# EAGLE design telekinesis-eagle (EAGLE 7.1.0)
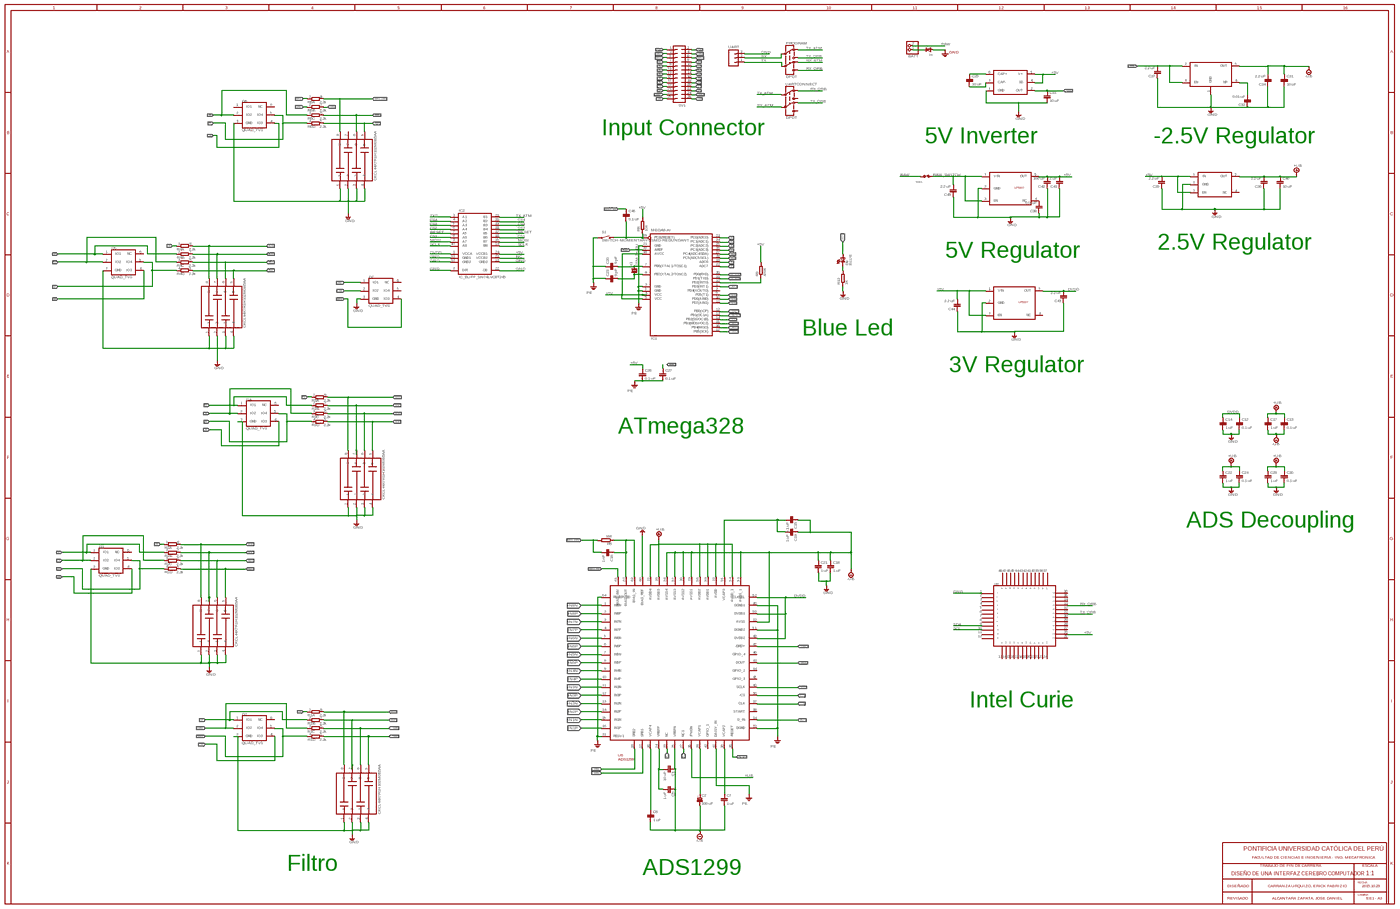
[diagram p0: schematic, sheet 1, overview]
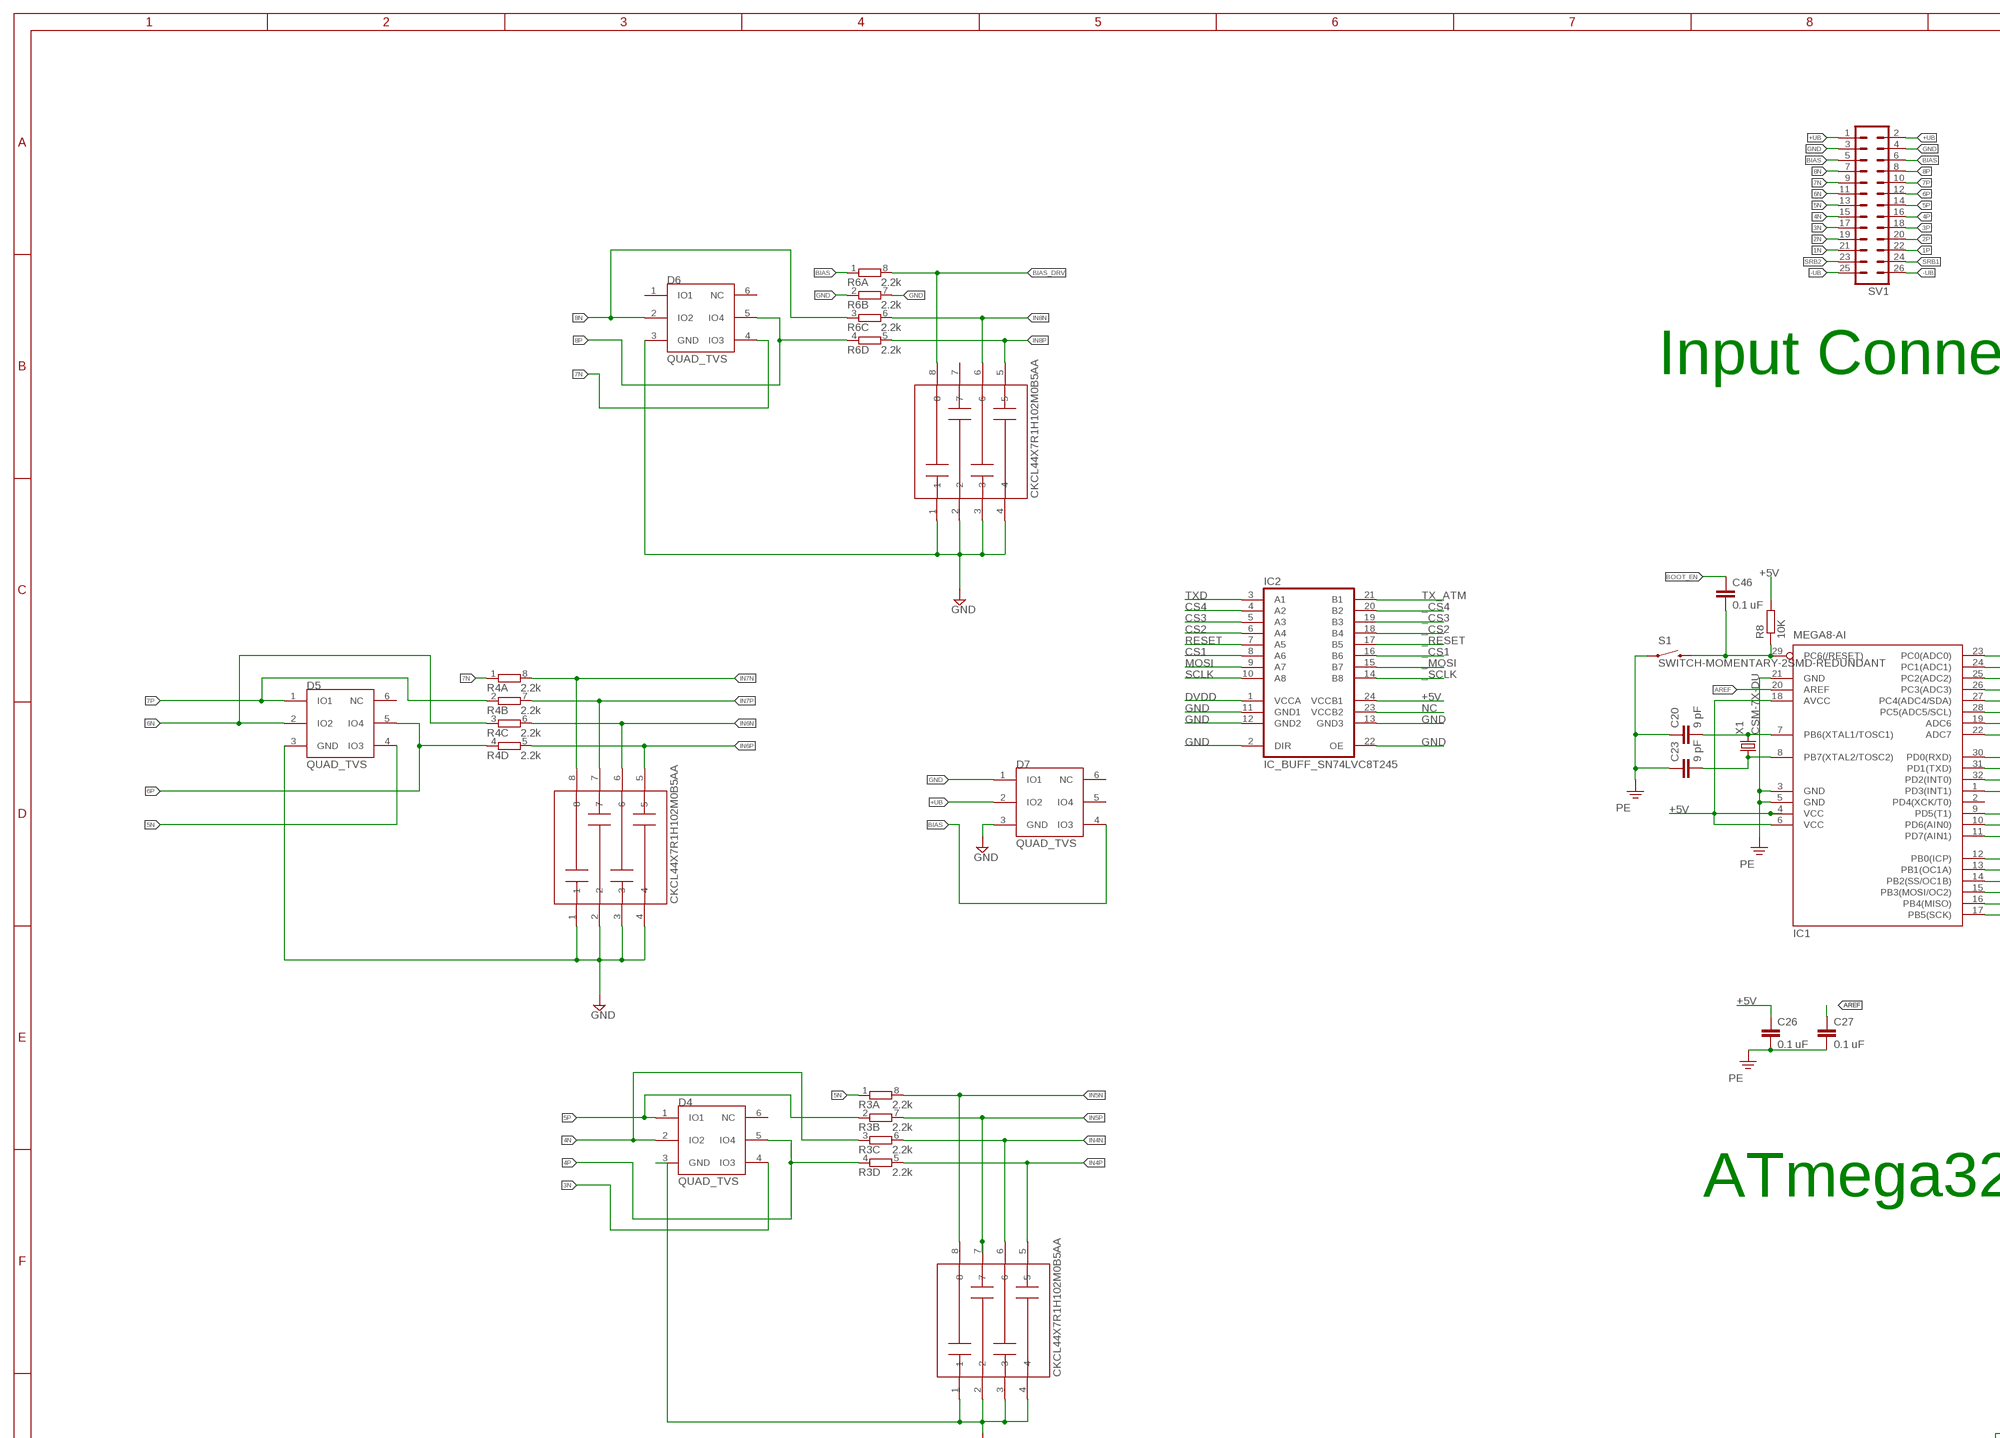
[diagram p1: schematic, sheet 1, part 1 of 4]
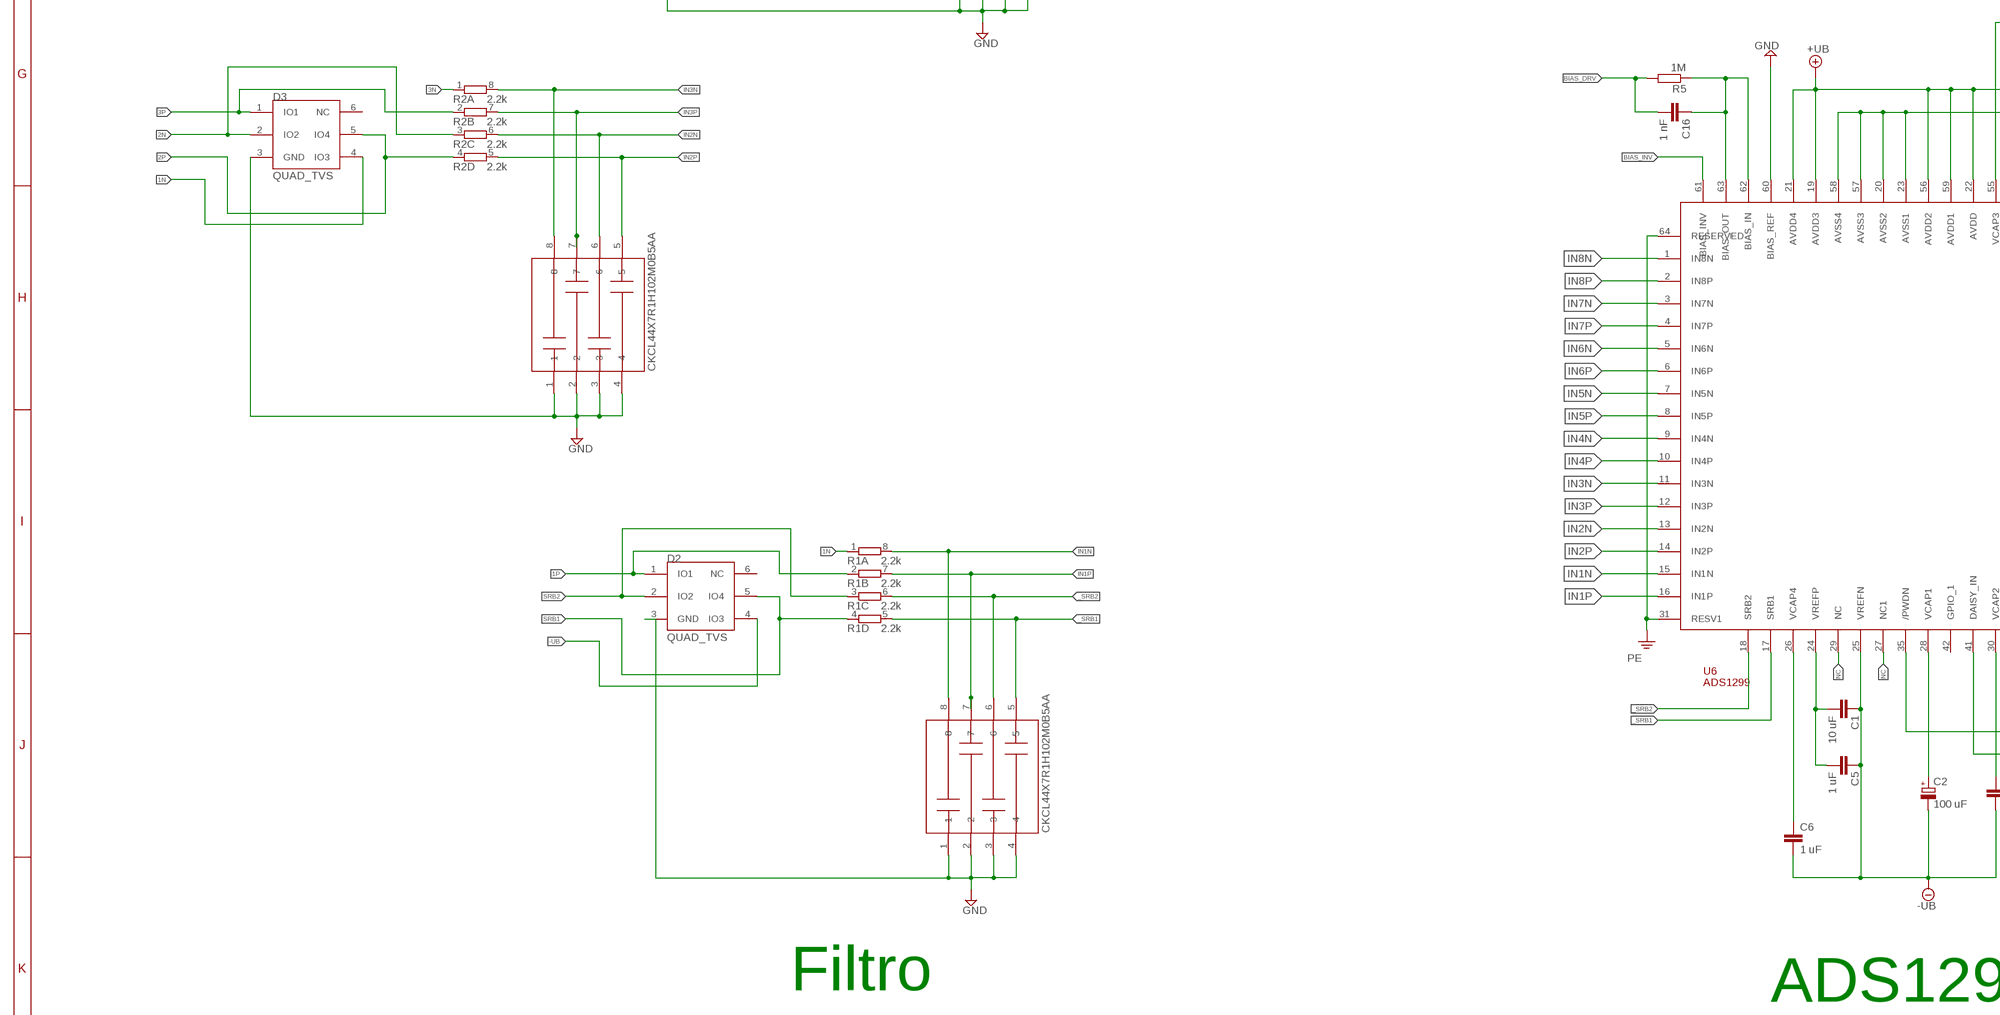
[diagram p2: schematic, sheet 1, part 2 of 4]
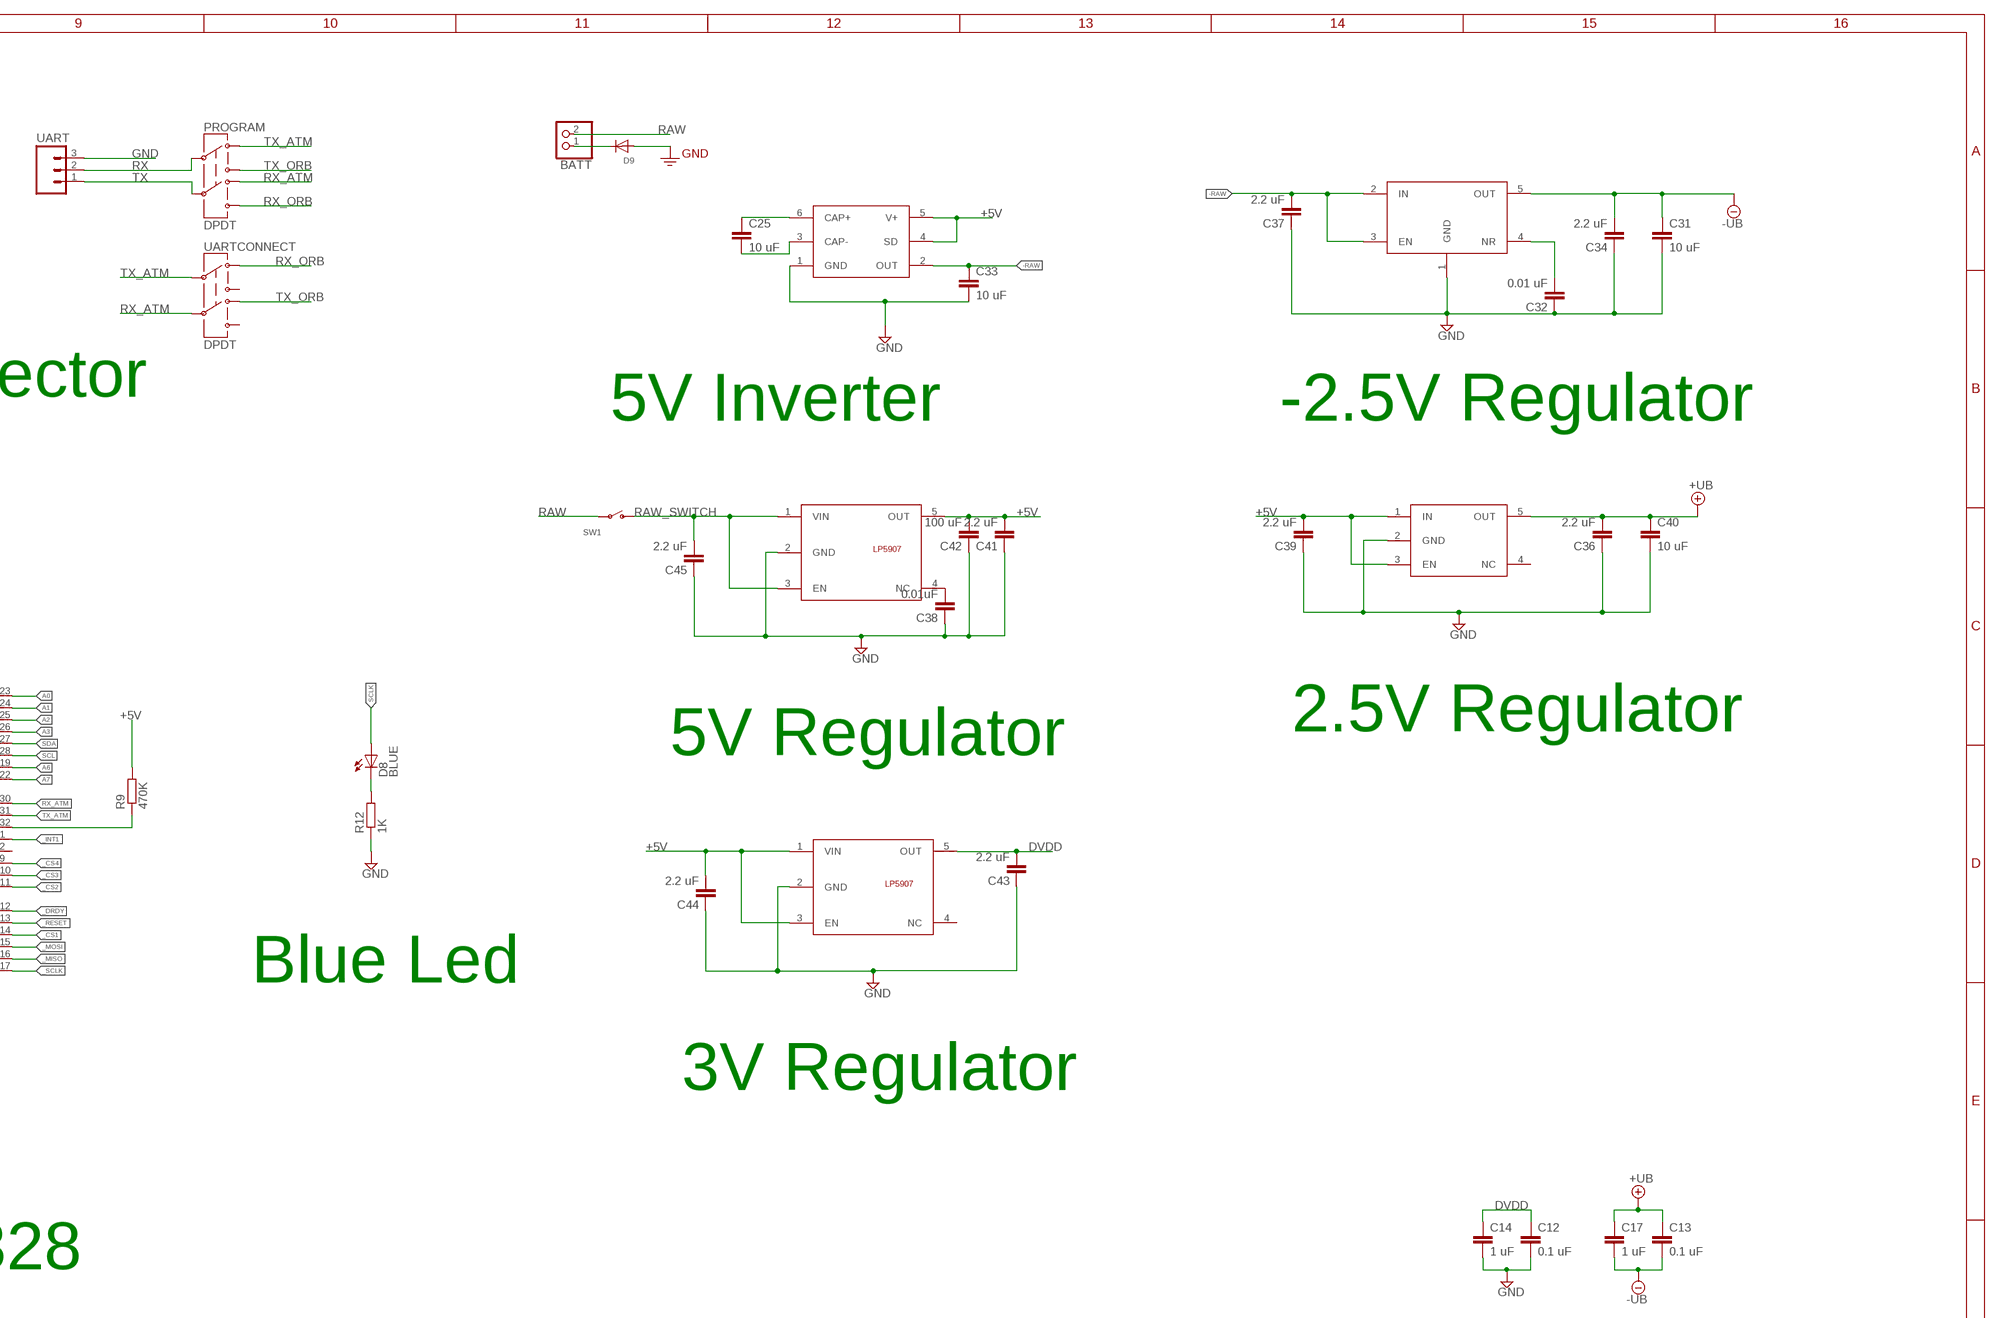
[diagram p3: schematic, sheet 1, part 3 of 4]
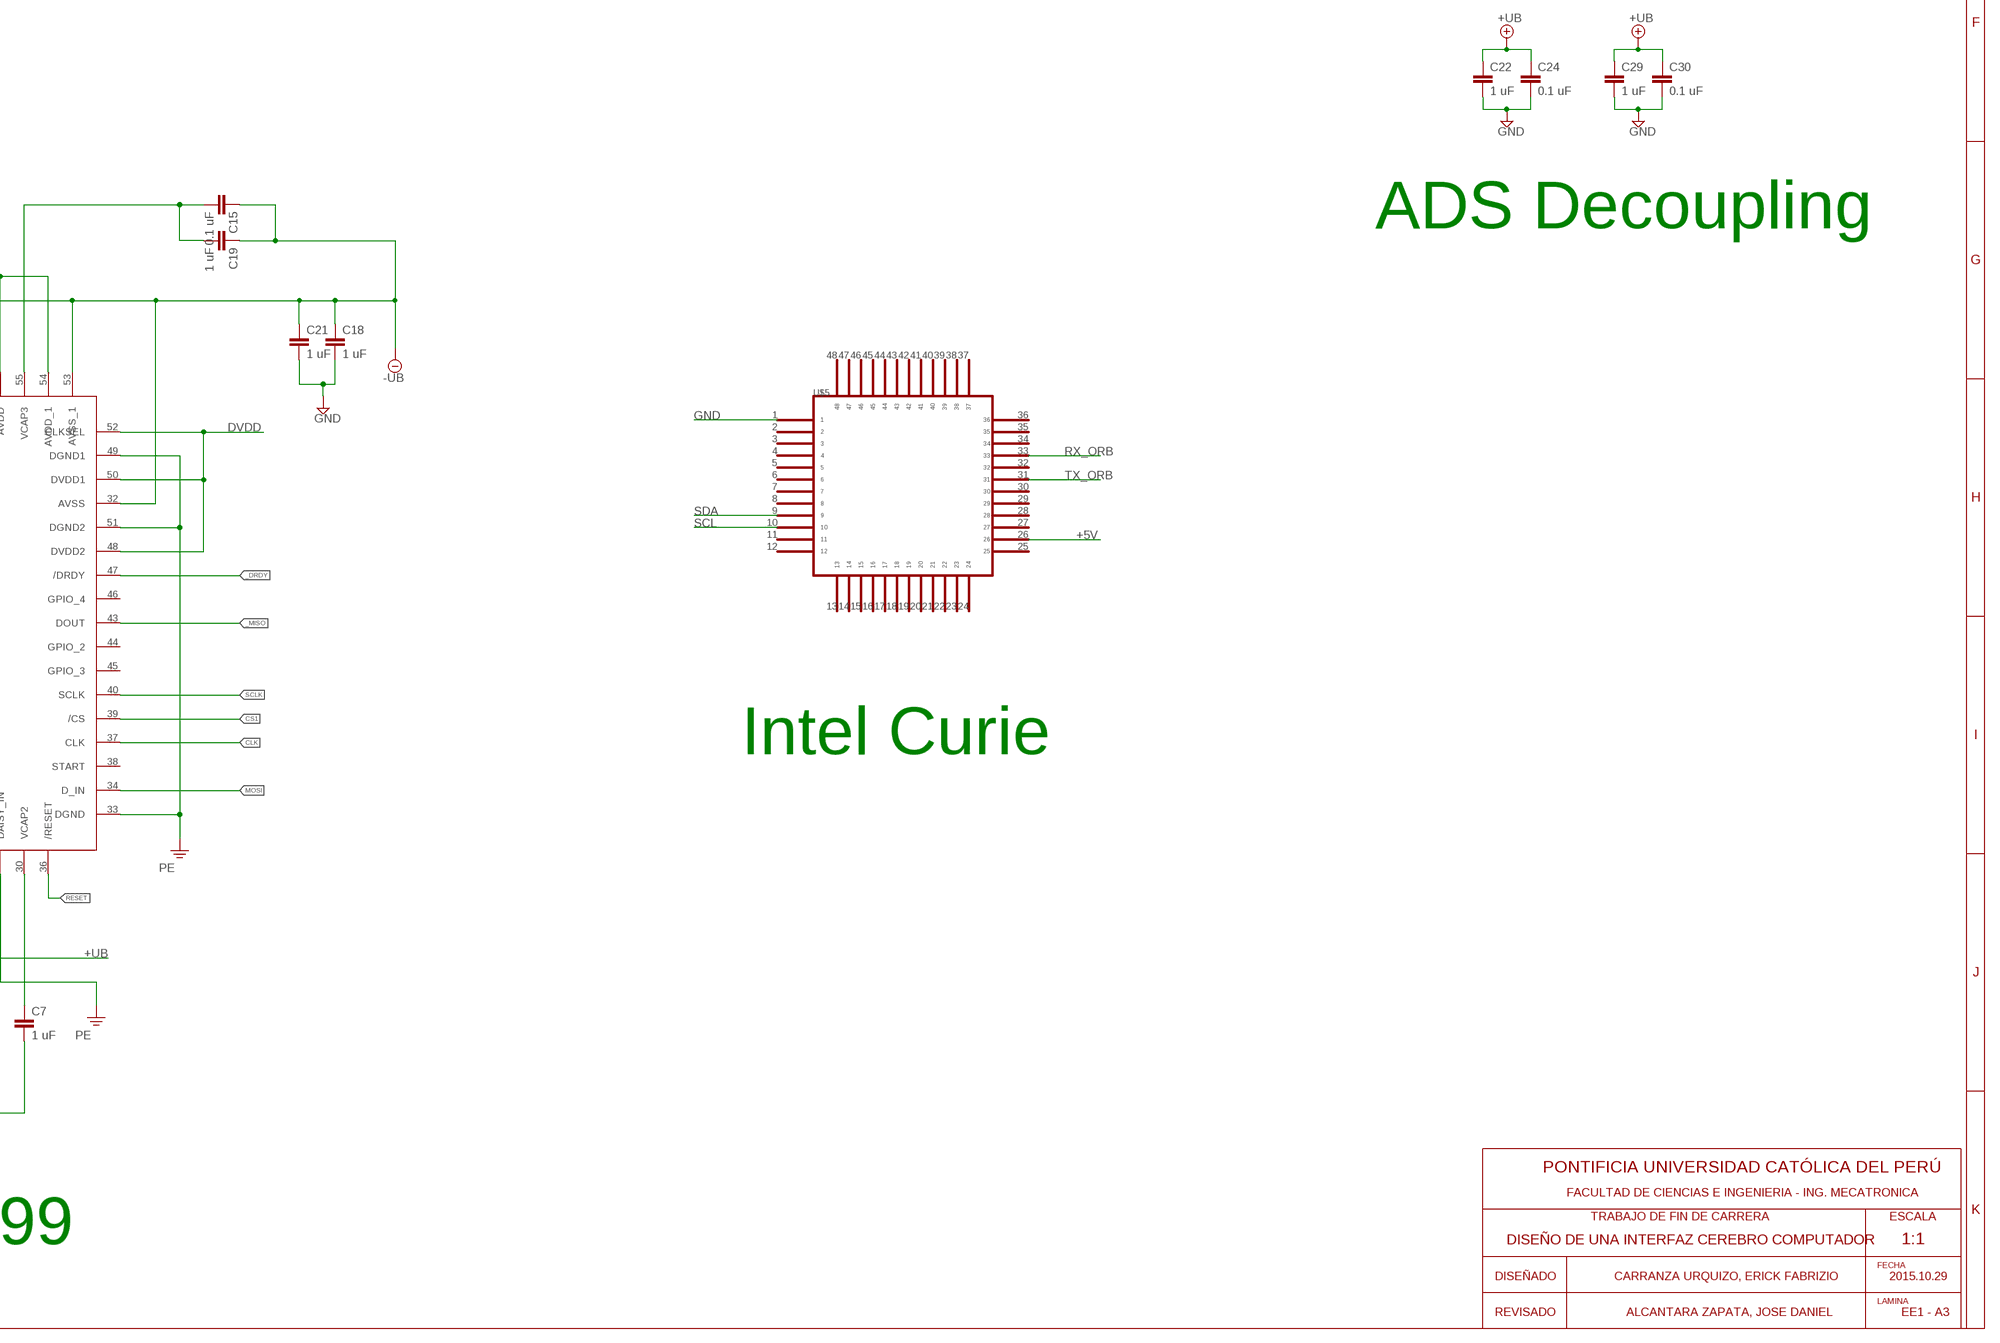
[diagram p4: schematic, sheet 1, part 4 of 4]

## Parts
BATT  JST_2PIN  [JSTPH2]
C1  10 uF  C-EUC0805K  [C0805K]
C2  100 uF  CPOL-EUC/6032-28R  [C/6032-28R]
C3  CKCL44X7R1H102M0B5AA  [CKCL44]
C5  1 uF  C-EUC0805K  [C0805K]
C6  1 uF  C-EUC0805K  [C0805K]
C7  1 uF  C-EUC0805K  [C0805K]
C9  CKCL44X7R1H102M0B5AA  [CKCL44]
C11  CKCL44X7R1H102M0B5AA  [CKCL44]
C12  0.1 uF  C-EUC0805K  [C0805K]
C13  0.1 uF  C-EUC0805K  [C0805K]
C14  1 uF  C-EUC0805K  [C0805K]
C15  0.1 uF  C-EUC0805K  [C0805K]
C16  1 nF  C-EUC0805K  [C0805K]
C17  1 uF  C-EUC0805K  [C0805K]
C18  1 uF  C-EUC0805K  [C0805K]
C19  1 uF  C-EUC0805K  [C0805K]
C20  9 pF  C-EUC0805K  [C0805K]
C21  1 uF  C-EUC0805K  [C0805K]
C22  1 uF  C-EUC0805K  [C0805K]
C23  9 pF  C-EUC0805K  [C0805K]
C24  0.1 uF  C-EUC0805K  [C0805K]
C25  10 uF  C-EUC0805K  [C0805K]
C26  0.1 uF  C-EUC0805K  [C0805K]
C27  0.1 uF  C-EUC0805K  [C0805K]
C28  CKCL44X7R1H102M0B5AA  [CKCL44]
C29  1 uF  C-EUC0805K  [C0805K]
C30  0.1 uF  C-EUC0805K  [C0805K]
C31  10 uF  C-EUC0805K  [C0805K]
C32  0.01 uF  C-EUC0805K  [C0805K]
C33  10 uF  C-EUC0805K  [C0805K]
C34  2.2 uF  C-EUC0805K  [C0805K]
C35  CKCL44X7R1H102M0B5AA  [CKCL44]
C36  2.2 uF  C-EUC0805K  [C0805K]
C37  2.2 uF  C-EUC0805K  [C0805K]
C38  0.01uF  C-EUC0805K  [C0805K]
C39  2.2 uF  C-EUC0805K  [C0805K]
C40  10 uF  C-EUC0805K  [C0805K]
C41  2.2 uF  C-EUC0805K  [C0805K]
C42  100 uF  C-EUC0805K  [C0805K]
C43  2.2 uF  C-EUC0805K  [C0805K]
C44  2.2 uF  C-EUC0805K  [C0805K]
C45  2.2 uF  C-EUC0805K  [C0805K]
C46  0.1 uF  C-EUC0805K  [C0805K]
D2  QUAD_TVS  [QUAD_TVS]
D3  QUAD_TVS  [QUAD_TVS]
D4  QUAD_TVS  [QUAD_TVS]
D5  QUAD_TVS  [QUAD_TVS]
D6  QUAD_TVS  [QUAD_TVS]
D7  QUAD_TVS  [QUAD_TVS]
D8  BLUE  LEDSML0603  [SML0603]
D9  DIODESOD-123  [SOD-123]
IC1  MEGA8-AI  [TQFP32-08]
IC2  IC_BUFF_SN74LVC8T245  [SOIC-24]
PROGRAM  DPDT  SWITCH-DPDTAYZ0202  [AYZ0202]
R1  2.2k  4R-NCAY16  [CAY16]
R2  2.2k  4R-NCAY16  [CAY16]
R3  2.2k  4R-NCAY16  [CAY16]
R4  2.2k  4R-NCAY16  [CAY16]
R5  1M  R-EU_R0805W  [R0805W]
R6  2.2k  4R-NCAY16  [CAY16]
R8  10K  R-EU_R0805W  [R0805W]
R9  470K  R-EU_R0805W  [R0805W]
R12  1K  R-EU_R0805W  [R0805W]
S1  SWITCH-MOMENTARY-2SMD-REDUNDANT  [TACTILE-SWITCH-SMD]
SV1  MA13-2W  [MA13-2W]
SW1  SWITCH_SPST  [SPST_SMT_19192]
U3  LM2664  [SOT-23-6]
U4  TLV700XX  [SC70-5]
U5  LP5907  [LP5907]
U6  ADS_1299  [TQFP64_ADS]
U9  LP5907  [LP5907]
U$5  ORB_0  [ORB_52_22MM]
UART  M03PTH  [1X03]
UARTCONNECT  DPDT  SWITCH-DPDTAYZ0202  [AYZ0202]
VR1  TPS72325  [SM]
X1  CSM-7X-DU  [CSM-7X-DU]

## Nets
1N: D3.4(IO3) R1.1 SV1.21
1P: D2.1(IO1) R1.2 SV1.22
2N: D3.2(IO2) R2.3 SV1.19
2P: D3.5(IO4) R2.4 SV1.20
3N: D4.4(IO3) R2.1 SV1.17
3P: D3.1(IO1) R2.2 SV1.18
4N: D4.2(IO2) R3.3 SV1.15
4P: D4.5(IO4) R3.4 SV1.16
5N: D5.4(IO3) R3.1 SV1.13
5P: D4.1(IO1) R3.2 SV1.14
6N: D5.2(IO2) R4.3 SV1.11
6P: D5.5(IO4) R4.4 SV1.12
7N: D6.4(IO3) R4.1 SV1.9
7P: D5.1(IO1) R4.2 SV1.10
8N: D6.2(IO2) R6.3 SV1.7
8P: D6.5(IO4) R6.4 SV1.8
+5V: C26.1 C39.2 C41.2 C42.2 C44.2 IC1.4(VCC) IC1.6(VCC) IC1.18(AVCC) IC2.24(VCCB1) R8.2 R9.2 U3.4(SD) U3.5(V+) U4.1(IN) U4.3(EN) U5.1(VIN) U5.3(EN) U9.5(OUT) U$5.26
+UB: C13.1 C17.1 C22.1 C24.1 C29.1 C30.1 C36.2 C40.1 D7.2(IO2) SV1.1 SV1.2 U4.5(OUT) U6.19(AVDD3) U6.21(AVDD4) U6.22(AVDD) U6.35(/PWDN) U6.54(AVDD_1) U6.56(AVDD2) U6.59(AVDD1)
-RAW: C33.1 C37.2 U3.2(OUT) VR1.2(IN) VR1.3(EN)
-UB: C1.1 C2.- C5.1 C6.2 C7.2 C13.2 C15.1 C17.2 C18.1 C19.1 C21.1 C31.1 C34.2 D2.4(IO3) SV1.25 SV1.26 U6.20(AVSS2) U6.23(AVSS1) U6.25(VREFN) U6.32(AVSS) U6.53(AVSS_1) U6.57(AVSS3) U6.58(AVSS4) VR1.5(OUT)
_CS1: IC1.14(PB2(SS/OC1B)) IC2.16(B6)
_CS2: IC1.11(PD7(AIN1)) IC2.18(B4)
_CS3: IC1.10(PD6(AIN0)) IC2.19(B3)
_CS4: IC1.9(PD5(T1)) IC2.20(B2)
_DRDY: IC1.12(PB0(ICP)) U6.47(/DRDY)
_INT1: IC1.1(PD3(INT1))
_MISO: IC1.16(PB4(MISO)) U6.43(DOUT)
_MOSI: IC1.15(PB3(MOSI/OC2)) IC2.15(B7)
_RESET: IC1.13(PB1(OC1A)) IC2.17(B5)
_SCLK: IC1.17(PB5(SCK)) IC2.14(B8)
_SRB1: C3.5 R1.5 U6.17(SRB1)
_SRB2: C3.6 R1.6 U6.18(SRB2)
A0: IC1.23(PC0(ADC0))
A1: IC1.24(PC1(ADC1))
A2: IC1.25(PC2(ADC2))
A3: IC1.26(PC3(ADC3))
A6: IC1.19(ADC6)
A7: IC1.22(ADC7)
ARDUINO_RESET: C46.2 IC1.29(PC6(/RESET)) R8.1 S1.3 S1.4
AREF: C27.1 IC1.20(AREF)
BIAS: D7.4(IO3) R6.1 SV1.5 SV1.6
BIAS_DRV: C16.2 C35.8 R5.2 R6.8
BIAS_INV: U6.61(BIAS_INV)
BOOT_EN: C46.1
CLK: U6.37(CLK)
CS1: IC2.8(A6) U6.39(/CS)
CS2: IC2.6(A4)
CS3: IC2.5(A3)
CS4: IC2.4(A2)
DVDD: C12.1 C14.1 C43.2 IC2.1(VCCA) U5.5(OUT) U6.48(DVDD2) U6.50(DVDD1) U6.52(CLKSEL)
GND: C3.1 C3.2 C3.3 C3.4 C9.1 C9.2 C9.3 C9.4 C11.1 C11.2 C11.3 C11.4 C12.2 C14.2 C18.2 C21.2 C22.2 C24.2 C28.1 C28.2 C28.3 C28.4 C29.2 C30.2 C31.2 C32.1 C33.2 C34.1 C35.1 C35.2 C35.3 C35.4 C36.1 C37.1 C38.1 C39.1 C40.2 C41.1 C42.1 C43.1 C44.1 C45.1 D2.3(GND) D3.3(GND) D4.3(GND) D5.3(GND) D6.3(GND) D7.1(IO1) D7.3(GND) D9.A IC2.2(DIR) IC2.11(GND1) IC2.12(GND2) IC2.13(GND3) IC2.22(OE) R6.2 R6.7 R12.1 SV1.3 SV1.4 U3.1(GND) U4.2(GND) U5.2(GND) U6.31(RESV1) U6.33(DGND) U6.41(DAISY_IN) U6.49(DGND1) U6.51(DGND2) U6.60(BIAS_REF) U6.64(RESERVED) U9.2(GND) U$5.1 UART.3 VR1.1(GND) ; supply symbol labelled GND2, PE
IN1N: C3.8 R1.8 U6.15(IN1N)
IN1P: C3.7 R1.7 U6.16(IN1P)
IN2N: C9.6 R2.6 U6.13(IN2N)
IN2P: C9.5 R2.5 U6.14(IN2P)
IN3N: C9.8 R2.8 U6.11(IN3N)
IN3P: C9.7 R2.7 U6.12(IN3P)
IN4N: C11.6 R3.6 U6.9(IN4N)
IN4P: C11.5 R3.5 U6.10(IN4P)
IN5N: C11.8 R3.8 U6.7(IN5N)
IN5P: C11.7 R3.7 U6.8(IN5P)
IN6N: C28.6 R4.6 U6.5(IN6N)
IN6P: C28.5 R4.5 U6.6(IN6P)
IN7N: C28.8 R4.8 U6.3(IN7N)
IN7P: C28.7 R4.7 U6.4(IN7P)
IN8N: C35.6 R6.6 U6.1(IN8N)
IN8P: C35.5 R6.5 U6.2(IN8P)
MOSI: IC2.9(A7) U6.34(D_IN)
N$1: IC1.32(PD2(INT0)) R9.1
N$2: C20.2 IC1.7(PB6(XTAL1/TOSC1)) X1.2
N$3: C23.2 IC1.8(PB7(XTAL2/TOSC2)) X1.1
N$4: C16.1 R5.1 U6.62(BIAS_IN) U6.63(BIAS_OUT)
N$5: C15.2 C19.2 U6.55(VCAP3)
N$6: C6.1 U6.26(VCAP4)
N$7: C1.2 C5.2 U6.24(VREFP)
N$8: C2.+ U6.28(VCAP1)
N$9: C25.1 U3.6(CAP+)
N$10: C7.1 U6.30(VCAP2)
N$11: C25.2 U3.3(CAP-)
N$12: C32.2 VR1.4(NR)
N$14: D8.C R12.2
N$38: C38.2 U9.4(NC)
NC: IC2.23(VCCB2) U6.27(NC1) U6.29(NC)
NULL: BATT.1 D9.C
PE: C20.1 C23.1 C26.2 C27.2 IC1.3(GND) IC1.5(GND) IC1.21(GND) S1.1 S1.2
RAW: BATT.2 SW1.B(P)
RAW_SWITCH: C45.2 SW1.C(S) U9.1(VIN) U9.3(EN)
RESET: IC2.7(A5) U6.36(/RESET)
RX: PROGRAM.2 UART.2
RX_ATM: IC1.30(PD0(RXD)) PROGRAM.4 UARTCONNECT.5
RX_ORB: PROGRAM.6 U$5.33 UARTCONNECT.1
SCL: IC1.28(PC5(ADC5/SCL)) U$5.10
SCLK: D8.A IC2.10(A8) U6.40(SCLK)
SDA: IC1.27(PC4(ADC4/SDA)) U$5.9
SRB1: D2.5(IO4) R1.4 SV1.24
SRB2: D2.2(IO2) R1.3 SV1.23
TX: PROGRAM.5 UART.1
TX_ATM: IC1.31(PD1(TXD)) IC2.21(B1) PROGRAM.1 UARTCONNECT.2
TX_ORB: PROGRAM.3 U$5.31 UARTCONNECT.4
TXD: IC2.3(A1)
Unconnected: C35.7 D2.6(NC) D3.6(NC) D4.6(NC) D5.6(NC) D6.1(IO1) D6.6(NC) D7.5(IO4) D7.6(NC) IC1.2(PD4(XCK/T0)) U4.4(NC) U5.4(NC) U6.38(START) U6.42(GPIO_1) U6.44(GPIO_2) U6.45(GPIO_3) U6.46(GPIO_4) U$5.2 U$5.3 U$5.4 U$5.5 U$5.6 U$5.7 U$5.8 U$5.11 U$5.12 U$5.13 U$5.14 U$5.15 U$5.16 U$5.17 U$5.18 U$5.19 U$5.20 U$5.21 U$5.22 U$5.23 U$5.24 U$5.25 U$5.27 U$5.28 U$5.29 U$5.30 U$5.32 U$5.34 U$5.35 U$5.36 U$5.37 U$5.38 U$5.39 U$5.40 U$5.41 U$5.42 U$5.43 U$5.44 U$5.45 U$5.46 U$5.47 U$5.48 UARTCONNECT.3 UARTCONNECT.6

## Notes on the sheet
- Input Connector
- 5V Inverter | -2.5V Regulator
- 2.5V Regulator
- 5V Regulator
- Blue Led
- 3V Regulator
- ATmega328
- ADS Decoupling
- Intel Curie
- Filtro | ADS1299

## Library data of the parts
BATT = microbuilder:JST_2PIN: JST 2-Pin Right-Angle Connector PH-Series - 4UConnector: 17311 SH-Series - 4UConnector: 07278
C1 C5-C7 C12-C27 C29-C34 C36-C46 = resistor:C-EU: CAPACITOR, European symbol
C2 = rcl:CPOL-EU: POLARIZED CAPACITOR, European symbol
C3 C9 C11 C28 C35 = TesisErick:CKCL44X7R1H102M0B5AA
D2-D7 = TVS_DIODE:QUAD_TVS
D8 = led:LED: LED OSRAM: - CHIPLED LG R971, LG N971, LY N971, LG Q971, LY Q971, LO R971, LY R971 LH N974, LH R974 LS Q976, LO Q976, LY Q976 LO Q996 - Hyper CHIPLED LW Q18S LB Q993, LB Q99A, LB R99A - SideLED LS A670, LO A670, LY A670, LG A670, LP A670 LB A673, LV A673, LT A673, LW A673 LH A674 LY A675 LS A676, LA A676, LO A676, LY A676, LW A676 LS A679, LY A679, LG A679 - Hyper Micro SIDELED® LS Y876, LA Y876, LO Y876, LY Y876 LT Y87S - SmartLED LW L88C, LW L88S LB L89C, LB L89S, LG L890 LS L89K, LO L89K, LY L89K LS L896, LA L896, LO L896, LY L896 - TOPLED LS T670, LO T670, LY T670, LG T670, LP T670 LSG T670, LSP T670, LSY T670, LOP T670, LYG T670 LG T671, LOG T671, LSG T671 LB T673, LV T673, LT T673, LW T673 LH T674 LS T676, LA T676, LO T676, LY T676, LB T676, LH T676, LSB T676, LW T676 LB T67C, LV T67C, LT T67C, LS T67K, LO T67K, LY T67K, LW E67C LS E67B, LA E67B, LO E67B, LY E67B, LB E67C, LV E67C, LT E67C LW T67C LS T679, LY T679, LG T679 LS T770, LO T770, LY T770, LG T770, LP T770 LB T773, LV T773, LT T773, LW T773 LH T774 LS E675, LA E675, LY E675, LS T675 LS T776, LA T776, LO T776, LY T776, LB T776 LHGB T686 LT T68C, LB T68C - Hyper Mini TOPLED® LB M676 - Mini TOPLED Santana® LG M470 LS M47K, LO M47K, LY M47K Source: http://www.osram.convergy.de LUXEON: - LUMILED® LXK2-PW12-R00, LXK2-PW12-S00, LXK2-PW14-U00, LXK2-PW14-V00 LXK2-PM12-R00, LXK2-PM12-S00, LXK2-PM14-U00 LXK2-PE12-Q00, LXK2-PE12-R00, LXK2-PE12-S00, LXK2-PE14-T00, LXK2-PE14-U00 LXK2-PB12-K00, LXK2-PB12-L00, LXK2-PB12-M00, LXK2-PB14-N00, LXK2-PB14-P00, LXK2-PB14-Q00 LXK2-PR12-L00, LXK2-PR12-M00, LXK2-PR14-Q00, LXK2-PR14-R00 LXK2-PD12-Q00, LXK2-PD12-R00, LXK2-PD12-S00 LXK2-PH12-R00, LXK2-PH12-S00 LXK2-PL12-P00, LXK2-PL12-Q00, LXK2-PL12-R00 Source: www.luxeon.com KINGBRIGHT: KA-3528ASYC Source: www.kingbright.com
D9 = microbuilder:DIODE: Diode SMA Model Volts Amps Type Vf Vr Digikey # Notes SSA34-E3 40V 3A Schottky 480mV @ 3A 200uA @ 40V SSA34-E3/61TGITR-ND CDBA120-G 20V 1A Schottky 500mV @ 1A 500uA @ 20V 641-1014-6-ND REEL MBRA210 10V 2A Schottky 350mV @ 2A 700uA @ 10V MBRA210LT3 SOD-123 Model Volts Amps Type Vf Vr Order # Notes BAT54T1G 30V 200mA Schottky 800mV @ 200mA 2uA @ 25V BAT54T1GOSTR-ND B0530W 30V 500mA Schottky 430mV @ 500mA 130uA @ 30V B0530W-FDICT-ND REEL MBR120 1A 20V Schottky 340mV @ 1A MBR120VLSFT1GOSCT-ND SOD-323 Model Volts Amps Type Vf Vr Order # Notes PMEG2005EJ 20V 500mA Schottky 355mV @ 500mA 568-4110-1-ND ZLLS410 10V 570mA Schottky 380mV @ 570mA ZLLS410CT-ND 1N4148WS 75V 150mA Silicon/Simple 1V 1N4148WSFSCT-ND REEL SOD-523 Model Volts Amps Type Vf Vr Order # Notes BAT54XV2 30V 200mA Schottky 0.8V @ 100mA BAT54XV2CT-ND TB751S 30V 30mA Schottky RB751S-40TE61CT-ND SOT23-R/W (R = Solder Paste/Reflow Ovens, W = Hand-Soldering) Model Volts Amps Type Vf Vr Order # Notes BAT54FILM 40V 300mA Schottky 497-7162-1-ND
IC1 = atmel:MEGA8: MICROCONTROLLER 8 Kbytes FLASH, 1 kbytes SRAM, 512 bytes EEPROM, USART, 6-channel 10 bit ADC, 2-channel 8 bit ADC Pin compatible with Atmega48, ATMega88, ATMega168 Source: avr.lbr; MPN: ATMEGA8-16AU; OC_FARNELL: 9171371; OC_NEWARK: 73M8863
IC2 = dp_devices:IC_BUFF_SN74LVC8T245
PROGRAM UARTCONNECT = SparkFun-Electromechanical:SWITCH-DPDT: DPDT Version of the COM-00597; PROD_ID: SWCH-08179
R1-R4 R6 = resistor-dil:4R-N: Array Chip Resistor Source: RS Component / Phycomp; OC_FARNELL: unknown; OC_NEWARK: unknown
R5 R8 R9 R12 = resistor:R-EU_: RESISTOR, European symbol
S1 = SparkFun-Electromechanical:SWITCH-MOMENTARY-2: Various NO switches- pushbuttons, reed, etc; PROD_ID: SWCH-08247
SV1 = con-lstb:MA13-2W: PIN HEADER; OC_FARNELL: unknown; OC_NEWARK: unknown
SW1 = microbuilder:SWITCH_SPST: Switch - SPST 4UCon 19192 (6.7x2.6mm SMT)
U3 = Inverter:LM2664
U4 = 2.5-Regulator:TLV700XX
U5 U9 = 3V-Regulator:LP5907
U6 = ADS1299:ADS_1299
U$5 = H99232-001-Rev01_egl:ORB_0: ORB_0
UART = SparkFun-Connectors:M03: Header 3 Standard 3-pin 0.1" header. Use with straight break away headers (SKU : PRT-00116), right angle break away headers (PRT-00553), swiss pins (PRT-00743), machine pins (PRT-00117), and female headers (PRT-00115). Molex polarized connector foot print use with SKU : PRT-08232 with associated crimp pins and housings.
VR1 = -2.5-Regulator:TPS72325
X1 = crystal:CSM-7X-DU: SMD CRYSTAL Source: www.ecsxtal.com .. Crystal 3.6864MHz CSM_7X_DU.PDF; OC_FARNELL: unknown; OC_NEWARK: unknown

## Board
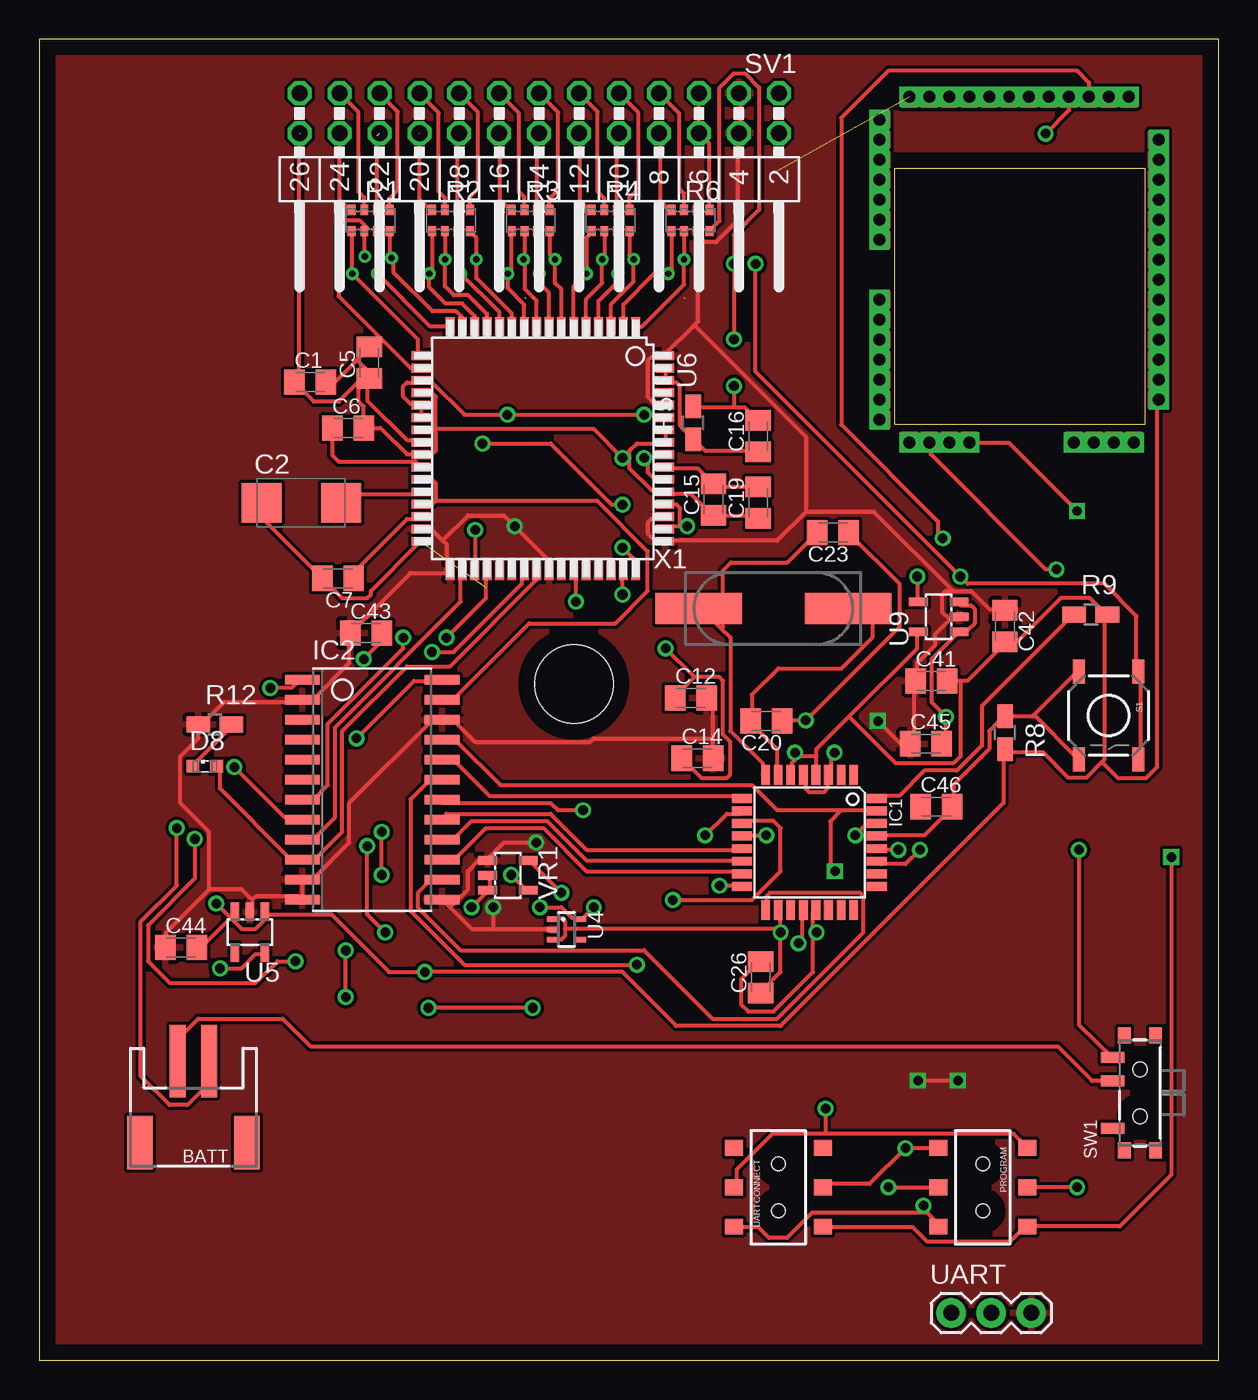
[diagram p5: board, top side]
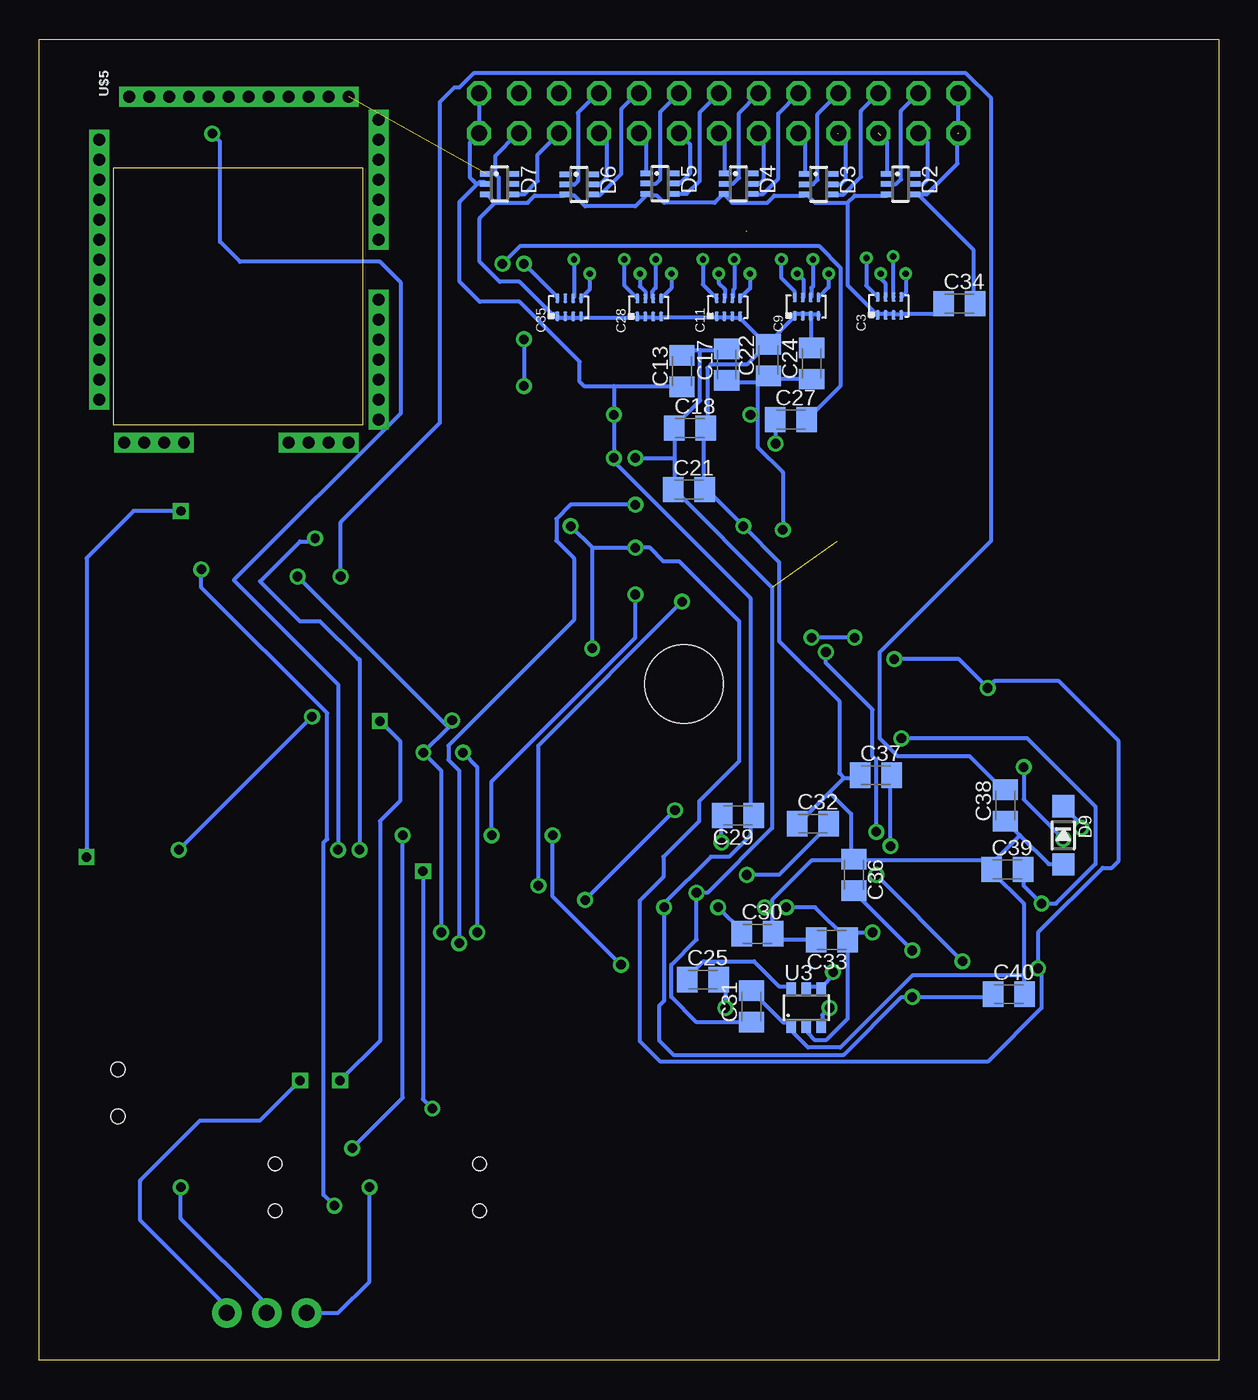
[diagram p6: board, bottom side, seen from below]

Size 75 x 84 mm. Coordinates in mm from the lower left corner, seen from the top.
Outline: 0,0 75,0 75,84 0,84 0,0
Outline: 54.4,59.5 54.4,75.8 70.3,75.8 70.3,59.5 54.4,59.5
Copper layers (1*16): Top 0.035mm / dielectric 1.5mm / Bottom 0.035mm
Design rules "default": minimum track width 10mil, minimum drill 24mil, track to track 8mil, track to pad 8mil, pad to pad 8mil, via to via 8mil, smd to smd 8mil, copper to edge 40mil, drill to drill 8mil, minimum pad ring 10mil, minimum via ring 8mil, stop-mask expansion 4mil, vias tented up to drill 0mil, thermal gap 10mil
Holes 5 mm at 34,43

### Footprints (pad centres in the part's own frame; a part is rotated, then mirrored left to right if it is on the bottom)
JSTPH2 = smd 1 x 4.6: 1 -1,-3.7; 2 1,-3.7 | smd 1.6 x 3.4: NC1 -3.4,1.5; NC2 3.4,1.5
C0805K = smd 1.3 x 1.6: 1 -1,0; 2 1,0
C/6032-28R = smd 2.55 x 2.5: + 2.525,0; - -2.525,0
CKCL44 = smd 0.25 x 0.6: 1 -0.75,-0.575; 2 -0.25,-0.575; 3 0.25,-0.575; 4 0.75,-0.575; 5 0.75,0.575; 6 0.25,0.575; 7 -0.25,0.575; 8 -0.75,0.575
QUAD_TVS = smd 0.35 x 0.8: 1 -0.65,-0.85; 2 0,-0.85; 3 0.65,-0.85; 4 0.65,0.85; 5 0,0.85; 6 -0.65,0.85
SML0603 = smd 0.8 x 0.8: A 0.75,0; C -0.75,0
SOD-123 = smd 1.4 x 1.4: A 1.85,0; C -1.85,0
TQFP32-08 = smd 1.27 x 0.559: 1 -4.293,2.8; 2 -4.293,2; 3 -4.293,1.2; 4 -4.293,0.4; 5 -4.293,-0.4; 6 -4.293,-1.2; 7 -4.293,-2; 8 -4.293,-2.8; 17 4.293,-2.8; 18 4.293,-2; 19 4.293,-1.2; 20 4.293,-0.4; 21 4.293,0.4; 22 4.293,1.2; 23 4.293,2; 24 4.293,2.8 | smd 0.559 x 1.27: 9 -2.8,-4.293; 10 -2,-4.293; 11 -1.2,-4.293; 12 -0.4,-4.293; 13 0.4,-4.293; 14 1.2,-4.293; 15 2,-4.293; 16 2.8,-4.293; 25 2.8,4.293; 26 2,4.293; 27 1.2,4.293; 28 0.4,4.293; 29 -0.4,4.293; 30 -1.2,4.293; 31 -2,4.293; 32 -2.8,4.293
SOIC-24 = smd 0.6 x 2.2: 1 -6.985,-4.445; 2 -5.715,-4.445; 3 -4.445,-4.445; 4 -3.175,-4.445; 5 -1.905,-4.445; 6 -0.635,-4.445; 7 0.635,-4.445; 8 1.905,-4.445; 9 3.175,-4.445; 10 4.445,-4.445; 11 5.715,-4.445; 12 6.985,-4.445; 13 6.985,4.445; 14 5.715,4.445; 15 4.445,4.445; 16 3.175,4.445; 17 1.905,4.445; 18 0.635,4.445; 19 -0.635,4.445; 20 -1.905,4.445; 21 -3.175,4.445; 22 -4.445,4.445; 23 -5.715,4.445; 24 -6.985,4.445
AYZ0202 = smd 1 x 1.15: 1 -2.5,2.825; 2 0,2.825; 3 2.5,2.825; 4 -2.5,-2.825; 5 0,-2.825; 6 2.5,-2.825 | hole 0.85: 1.5,0; -1.5,0
CAY16 = smd 0.5 x 0.65: 1 -1.2,-0.675; 2 -0.4,-0.675; 3 0.4,-0.675; 4 1.2,-0.675; 5 1.2,0.675; 6 0.4,0.675; 7 -0.4,0.675; 8 -1.2,0.675
R0805W = smd 1.5 x 1: 1 -1.052,0; 2 1.052,0
TACTILE-SWITCH-SMD = smd 1.524 x 0.762: 1 -2.794,1.905; 2 2.794,1.905; 3 -2.794,-1.905; 4 2.794,-1.905
MA13-2W = drill 1.016 octagon: 1 -15.24,-1.27; 2 -15.24,1.27; 3 -12.7,-1.27; 4 -12.7,1.27; 5 -10.16,-1.27; 6 -10.16,1.27; 7 -7.62,-1.27; 8 -7.62,1.27; 9 -5.08,-1.27; 10 -5.08,1.27; 11 -2.54,-1.27; 12 -2.54,1.27; 13 0,-1.27; 14 0,1.27; 15 2.54,-1.27; 16 2.54,1.27; 17 5.08,-1.27; 18 5.08,1.27; 19 7.62,-1.27; 20 7.62,1.27; 21 10.16,-1.27; 22 10.16,1.27; 23 12.7,-1.27; 24 12.7,1.27; 25 15.24,-1.27; 26 15.24,1.27
SPST_SMT_19192 = smd 0.7 x 1.5: A -2.25,1.75; B 0.75,1.75; C 2.25,1.75 | smd 1 x 0.8: GND1 -3.65,1; GND2 -3.65,-1; GND3 3.65,1; GND4 3.65,-1 | hole 0.9: -1.5,0; 1.5,0
SOT-23-6 = smd 0.6 x 0.9: 1 -0.95,-1.15; 2 0,-1.15; 3 0.95,-1.15; 4 0.95,1.15; 5 0,1.15; 6 -0.95,1.15
SC70-5 = smd 0.35 x 0.8: 1 0.62,1.69; 2 1.27,1.69; 3 1.92,1.69; 4 1.92,3.39; 5 0.62,3.39
LP5907 = smd 0.55 x 1.2: 1 1.59,1.24; 2 2.54,1.24; 3 3.49,1.24; 4 3.49,3.84; 5 1.59,3.84
TQFP64_ADS = smd 1.194 x 0.559: 1 -7.76,5.905; 2 -7.76,5.118; 3 -7.76,4.331; 4 -7.76,3.543; 5 -7.76,2.756; 6 -7.76,1.968; 7 -7.76,1.181; 8 -7.76,0.394; 9 -7.76,-0.394; 10 -7.76,-1.181; 11 -7.76,-1.968; 12 -7.76,-2.756; 13 -7.76,-3.543; 14 -7.76,-4.331; 15 -7.76,-5.118; 16 -7.76,-5.905; 33 7.76,-5.905; 34 7.76,-5.118; 35 7.76,-4.331; 36 7.76,-3.543; 37 7.76,-2.756; 38 7.76,-1.968; 39 7.76,-1.181; 40 7.76,-0.394; 41 7.76,0.394; 42 7.76,1.181; 43 7.76,1.968; 44 7.76,2.756; 45 7.76,3.543; 46 7.76,4.331; 47 7.76,5.118; 48 7.76,5.905 | smd 0.559 x 1.194: 17 -5.905,-7.76; 18 -5.118,-7.76; 19 -4.331,-7.76; 20 -3.543,-7.76; 21 -2.756,-7.76; 22 -1.968,-7.76; 23 -1.181,-7.76; 24 -0.394,-7.76; 25 0.394,-7.76; 26 1.181,-7.76; 27 1.968,-7.76; 28 2.756,-7.76; 29 3.543,-7.76; 30 4.331,-7.76; 31 5.118,-7.76; 32 5.905,-7.76; 49 5.905,7.76; 50 5.118,7.76; 51 4.331,7.76; 52 3.543,7.76; 53 2.756,7.76; 54 1.968,7.76; 55 1.181,7.76; 56 0.394,7.76; 57 -0.394,7.76; 58 -1.181,7.76; 59 -1.968,7.76; 60 -2.756,7.76; 61 -3.543,7.76; 62 -4.331,7.76; 63 -5.118,7.76; 64 -5.905,7.76
ORB_52_22MM = drill 0.762 pad 1.092 square: 1 0,15.875; 2 0,14.605; 3 0,13.335; 4 0,12.065; 5 0,10.795; 6 0,9.525; 7 0,8.255; 8 0,6.985; 9 0,5.715; 10 0,4.445; 11 0,3.175; 12 0,1.905; 13 2.745,0; 14 4.015,0; 15 5.285,0; 16 6.555,0; 17 7.825,0; 18 9.095,0; 19 10.365,0; 20 11.635,0; 21 12.905,0; 22 14.175,0; 23 15.445,0; 24 16.715,0; 25 17.985,0; 26 19.255,0; 27 22,1.587; 28 22,2.857; 29 22,4.128; 30 22,5.397; 31 22,12.065; 32 22,13.335; 33 22,14.605; 34 22,15.875; 35 20.525,17.78; 36 19.255,17.78; 37 17.985,17.78; 38 16.715,17.78; 39 15.445,17.78; 40 14.175,17.78; 41 12.905,17.78; 42 9.095,17.78; 43 7.825,17.78; 44 6.555,17.78; 45 5.285,17.78; 46 4.015,17.78; 47 2.745,17.78; 48 1.475,17.78
1X03 = drill 1.016 pad 1.88: 1 0,0; 2 2.54,0; 3 5.08,0
SM = smd 0.55 x 1.2: 1 1.59,1.24; 2 2.54,1.24; 3 3.49,1.24; 4 3.49,3.84; 5 1.59,3.84
CSM-7X-DU = smd 5.5 x 2: 1 -4.75,0; 2 4.75,0

### Placement (x,y rotation side)
BATT  9.8,15.33 180 top
C1  17.23,62.2 0 top
C2  16.66,54.53 0 top
C3  20.93,67.04 0 bottom
C5  20.99,63.44 90 top
C6  19.63,59.28 0 top
C7  18.99,49.72 180 top
C9  26.2,67 0 bottom
C11  31.18,66.96 0 bottom
C12  41.44,42.12 0 top
C13  34.12,62.91 90 bottom
C14  41.85,38.28 0 top
C15  42.88,54.74 90 top
C16  45.72,58.77 90 top
C17  31.28,63.31 90 bottom
C18  33.61,59.28 0 bottom
C19  45.72,54.53 90 top
C20  46.24,40.64 180 top
C21  33.68,55.36 0 bottom
C22  28.64,63.6 90 bottom
C23  50.48,52.64 180 top
C24  25.88,63.39 90 bottom
C25  32.8,24.2 0 bottom
C26  45.88,24.34 90 top
C27  27.19,59.82 0 bottom
C28  36.21,66.94 0 bottom
C29  30.56,34.64 180 bottom
C30  29.34,27.12 0 bottom
C31  29.72,22.49 90 bottom
C32  25.79,34.12 0 bottom
C33  24.59,26.72 180 bottom
C34  16.49,67.2 0 bottom
C35  41.3,66.96 0 bottom
C36  23.2,30.86 270 bottom
C37  21.79,37.2 0 bottom
C38  13.57,35.27 90 bottom
C39  13.44,31.2 0 bottom
C40  13.33,23.28 0 bottom
C41  56.74,43.2 0 top
C42  61.4,46.68 270 top
C43  20.78,46.24 0 top
C44  9.02,26.24 0 top
C45  56.39,39.2 0 top
C46  57.04,35.2 0 top
D2  20.23,74.79 270 bottom
D3  25.43,74.78 270 bottom
D4  30.53,74.81 270 bottom
D5  35.53,74.82 270 bottom
D6  40.67,74.77 270 bottom
D7  45.73,74.8 270 bottom
D8  10.53,37.77 0 top
D9  9.89,33.38 270 bottom
IC1  48.99,32.93 270 top
IC2  21.17,36.28 270 top
PROGRAM  60,11 270 top
R1  21.07,72.48 180 top
R2  26.19,72.48 180 top
R3  31.25,72.48 180 top
R4  36.33,72.48 180 top
R5  41.58,59.61 90 top
R6  41.41,72.48 180 top
R8  61.42,39.91 270 top
R9  66.87,47.42 0 top
R12  11.17,40.42 0 top
S1  68,41 270 top
SV1  31.79,79.29 180 top
SW1  70,17 90 top
U3  26.22,22.42 0 bottom
U4  30.99,28.66 270 top
U5  15.93,29.76 180 top
U6  32.02,57.98 270 top
U9  59.74,44.74 90 top
U$5  71.2,80.35 270 bottom
UART  58,3 0 top
UARTCONNECT  47,11 90 top
VR1  27.26,33.37 270 top
X1  46.68,47.8 0 top

### Tracks (layer width: path | path; a pad name or v marks a point on that pad's centre or on a via)
1N
  Top 0.254: R1.1 22.27,73.87 22.8,74.4 22.8,79.39 SV1.21
  Bottom 0.254: D3.4 23.87,74.13 22.75,75.25 22.75,79.44 SV1.21
1P  (1 unrouted)
  Top 0.254: R1.2 21.47,77.86
  Bottom 0.254: D2.1 21.08,77.47 SV1.22
2N
  Top 0.254: R2.3 25.79,73.91 25.4,74.3 25.4,79.33 SV1.19
  Bottom 0.254: D3.2 25.79,74.78 25.5,75.07 25.5,79.23 SV1.19
2P  (1 unrouted)
  Top 0.254: R2.4 24.84,73.16 24.2,73.8 24.2,77.99
  Bottom 0.254: D3.5 24.02,74.78 23.7,75.1 23.7,77.55 SV1.20
3N
  Top 0.254: R2.1 27.39,73.99 27.9,74.5 27.9,79.37 SV1.17
  Bottom 0.254: D4.4 28.99,74.16 28,75.15 28,79.27 SV1.17
3P
  Top 0.254: R2.2 26.59,77.9 SV1.18
  Bottom 0.254: 26.38,77.69 SV1.18 26.28,77.59 D3.1
4N
  Top 0.254: R3.3 30.85,73.95 30.5,74.3 30.5,79.31 SV1.15
  Bottom 0.254: D4.2 30.89,74.81 30.5,75.2 30.5,79.31 SV1.15
4P
  Top 0.254: R3.4 29.95,73.16 29.3,73.8 29.3,77.97 SV1.16
  Bottom 0.254: D4.5 29.19,74.81 28.9,75.1 28.9,77.67 SV1.16
5N
  Top 0.254: R3.1 32.45,73.85 33,74.4 33,79.35 SV1.13
  Bottom 0.254: D5.4 33.83,74.17 33,75 33,79.35 SV1.13
5P
  Top 0.254: R3.2 31.65,77.88 SV1.14
  Bottom 0.254: 31.48,77.71 SV1.14 31.38,77.61 D4.1
6N
  Top 0.254: R4.3 35.93,73.87 35.5,74.3 35.5,79.39 SV1.11
  Bottom 0.254: D5.2 35.78,74.82 35.5,75.1 35.5,79.39 SV1.11
6P
  Top 0.254: R4.4 34.95,73.16 34.4,73.7 34.4,77.95 SV1.12
  Bottom 0.254: D5.5 34.28,74.82 33.6,75.5 33.6,77.29 SV1.12
7N
  Top 0.254: R4.1 37.53,73.93 38.1,74.5 38.1,79.33 SV1.9
  Bottom 0.254: D6.4 39.6,74.07 39.38,74.07 38.01,75.44 38.01,79.55 37.09,80.47 SV1.9
7P
  Top 0.254: R4.2 36.73,77.88 SV1.10
  Bottom 0.254: 36.48,77.63 SV1.10 36.38,77.53 D5.1
8N
  Top 0.254: R6.3 41.01,74.19 40.7,74.5 40.7,79.27 SV1.7
  Bottom 0.254: D6.2 41.43,74.75 40.98,74.75 40.75,74.98 40.75,79.32 39.6,80.47 SV1.7
8P
  Top 0.16: R6.4 40.05,73.16
  Top 0.254: 40.05,73.16 39.5,73.7 39.5,77.93 SV1.8
  Bottom 0.254: D6.5 39.6,74.75 39.38,74.75 38.92,75.21 38.92,77.5 39.38,77.95 SV1.8
+5V  (via drill 0.61)
  Top 0.254: 12.17,28.12 10.12,26.06 C44.2 | 12.17,28.12 12.4,28.35 U5.3 12.17,28.12 | 12.17,28.12 12.86,27.43 13.77,27.43 14.23,27.89 14.23,28.35 U5.1 14.46,28.35 18.57,28.35 22.23,24.69 v24.52,24.69 37.09,24.69 40.52,21.26 47.15,21.26 61.32,35.43 61.32,38.63 R8.2 61.55,38.63 63.84,38.63 65.44,37.03 66.58,37.03 67.58,38.03 | 12.17,28.12 v11.26,29.03 | v20.17,39.55 23.83,43.2 25.43,43.2 IC2.24 | 33.43,27.43 33.43,27.89 33.2,28.12 32.75,28.12 U4.1 | 33.43,27.43 33.43,26.98 33.2,26.75 32.75,26.75 U4.3 | 47.15,27.43 v47.15,27.2 47.15,24.69 46.01,23.55 C26.1 | 47.15,27.43 47.15,28.57 IC1.18 | 47.15,27.43 33.43,27.43 | 51.49,40.92 49.44,38.86 49.44,38.41 | 51.49,40.92 55.84,45.26 55.84,46.18 U9.5 | 49.44,38.41 49.44,37.26 IC1.4 | 48.29,38.41 47.84,37.95 47.84,37.26 IC1.6 | 49.44,38.41 48.29,38.41 | 58.58,43.2 59.04,43.2 61.32,45.49 C42.2 61.55,45.72 62.24,45.72 64.98,48.46 66.81,48.46 67.72,47.55 R9.2 67.72,47.32 67.72,38.18 67.58,38.03 | 58.58,43.2 57.89,43.2 C41.2 | 51.49,40.92 54.46,37.95 58.12,37.95 58.58,38.41 58.58,43.2 | 48.29,38.41 v48.06,38.63 | 67.58,38.03 68.58,37.03 70.41,37.03 71.09,37.72 71.09,61.04 U$5.26
  Bottom 0.254: U3.5 26.12,23.77 25.43,23.77 U3.4 25.2,23.77 24.52,24.46 v24.52,24.69 | C39.2 12.4,31.09 12.4,30.18 v11.26,29.03 10.34,29.03 7.83,31.55 7.83,35.2 12.17,39.55 v20.17,39.55 | v47.15,27.2 47.15,37.72 v48.06,38.63
+UB  (via drill 0.61)
  Top 0.254: v31.83,28.8 33.2,28.8 33.89,28.12 34.35,28.12 U4.5 34.58,28.12 v35.26,28.8 | v19.49,23.09 v19.49,26.06 | v27.72,52.81 27.72,50.29 U6.35 | U6.22 24.29,60.12 24.29,60.58 U6.21 24.06,60.81 23.6,60.81 23.15,61.27 23.15,61.95 23.38,62.18 24.06,62.18 U6.19 24.29,62.18 24.98,62.18 27.03,60.12 v29.77,60.12 v38.46,60.12 39.6,60.12 U6.59 | 38.69,57.15 38.69,56.46 39.15,56.01 39.6,56.01 U6.54 | 38.69,57.15 39.15,57.61 39.6,57.61 U6.56 | v38.46,57.38 38.69,57.15
  Bottom 0.254: SV1.1 SV1.2 47.6,77.45 47.6,75.2 47.38,74.98 | 47.38,74.98 47.2,74.8 D7.2 46.71,74.93 46.99,74.93 48.26,73.66 48.26,68.58 46.99,67.31 44.45,67.31 40.64,63.5 40.64,62.23 40.36,61.95 38.46,61.95 | v31.83,28.8 30.23,27.2 C30.1 | C40.1 14.46,23.09 v19.49,23.09 20.17,23.09 23.83,19.43 34.67,19.43 35.56,20.32 35.56,22.56 35.26,22.86 v35.26,28.8 35.26,29.03 32.29,32 31.15,32 29.77,33.38 29.77,34.52 C29.1 29.77,34.75 29.77,48.46 38.46,57.15 v38.46,57.38 v38.46,60.12 38.46,61.95 | v19.49,26.06 23.15,29.72 C36.2 | v27.72,52.81 27.72,56.46 29.32,58.06 29.32,60.12 | 29.32,60.12 29.32,61.95 29.09,62.18 | 29.09,62.18 28.86,62.41 C22.1 | C24.1 25.89,62.41 28.63,62.41 C22.1 | 29.09,62.18 31.15,62.18 C17.1 | 29.09,62.18 C22.1 | 38.46,61.95 34.35,61.95 C13.1 | 47.38,74.98 | v29.77,60.12 29.32,60.12
-RAW  (via drill 0.61)
  Top 0.254: VR1.2 28.63,30.63 28.63,29.95 VR1.3 28.4,29.72 v27.49,28.8 | v20.86,32.69 20.86,28.35 v22,27.2
  Bottom 0.254: U3.2 26.12,21.26 26.12,20.8 25.66,20.34 24.98,20.34 23.6,21.72 23.6,26.52 C33.1 | v27.49,28.8 25.66,28.8 23.6,26.75 C33.1 | v20.86,32.69 20.86,37.03 C37.2 | v22,27.2 22.92,27.2 23.38,26.75 C33.1
-UB  (via drill 0.61)  (2 unrouted)
  Top 0.254: U6.32 24.06,51.89 21.09,48.92 21.09,48.69 20.86,48.46 19.26,48.46 18.12,49.61 C7.2 17.89,49.84 14.23,53.49 14.23,54.41 C2.- | 25.2,58.98 25.2,57.84 24.98,57.61 24.29,57.61 U6.25 24.06,57.61 23.38,57.61 21.7,59.28 C6.2 20.63,60.65 20.32,60.96 20.32,61.77 C5.1 20.53,62.44 19.05,60.96 17.47,60.96 C1.1 16.52,62.49 16.52,77.95 SV1.26 | 25.2,58.98 24.98,59.21 24.29,59.21 U6.23 | 25.2,58.98 25.2,59.21 | 25.2,59.21 25.2,61.27 24.98,61.49 24.29,61.49 U6.20 | v33.2,29.72 31.15,31.77 VR1.5 | U6.58 39.83,58.98 39.83,58.52 U6.57 39.6,58.29 38.01,58.29 37.55,57.84 37.55,57.38 | 37.55,57.38 37.55,56.69 38.92,55.32 39.6,55.32 U6.53 39.83,55.09 41.43,55.09 42.81,53.72 C15.1 43.03,53.72 45.55,53.72 C19.1 | 37.55,57.38 v37.09,57.38 35.26,59.21 25.2,59.21
  Bottom 0.254: 16.6,77.97 16.6,76.1 18.56,74.14 D2.4 19.03,74.07 15.6,70.64 15.6,67.21 C34.2 | SV1.26 SV1.25 | C31.1 29.77,21.49 33.2,21.49 34.8,23.09 34.8,25.15 33.2,26.75 v33.2,29.72 32.52,29.72 28.4,33.83 28.4,49.15 34.58,55.32 C21.1 34.58,55.55 34.58,57.38 | 32.98,64.24 33.89,64.24 34.12,64.01 C13.2 | 32.98,64.24 31.38,64.24 C17.2 | 34.58,57.38 34.58,59.21 C18.1 34.58,59.44 32.98,61.04 32.98,64.24 | v37.09,57.38 34.58,57.38
_CS1
  Top 0.254: IC1.14 44.63,31.77 34.8,31.77 32.29,34.29 27.49,34.29 26.35,33.15 25.66,33.15 IC2.16
_CS2  (via drill 0.61)
  Top 0.254: v40.29,29.26 45.32,29.26 47.15,31.09 47.15,33.83 46.69,34.29 44.86,34.29 IC1.11 | v34.58,34.98 32.98,34.98 32.52,35.43 25.66,35.43 IC2.18
  Bottom 0.254: v34.58,34.98 v40.29,29.26
_CS3  (via drill 0.61)
  Top 0.254: v42.35,33.38 43.72,34.75 44.63,34.75 IC1.10 | v38.01,25.15 27.03,25.15 23.6,28.57 23.6,35.66 24.75,36.8 25.43,36.8 IC2.19
  Bottom 0.254: v42.35,33.38 42.35,29.49 v38.01,25.15
_CS4
  Top 0.254: IC1.9 44.63,35.89 28.63,35.89 26.35,38.18 25.66,38.18 IC2.20
_DRDY  (via drill 0.61)
  Top 0.254: v37.09,48.69 37.09,50.06 U6.47 | v46.23,33.38 44.86,33.38 IC1.12
  Bottom 0.254: v37.09,48.69 37.09,45.95 46.23,36.8 v46.23,33.38
_MISO  (via drill 0.61)
  Top 0.254: v34.12,48.23 34.12,50.06 U6.43 | v43.26,30.18 44.63,30.18 IC1.16
  Bottom 0.254: v34.12,48.23 43.26,39.09 v43.26,30.18
_MOSI
  Top 0.254: IC1.15 44.63,31.09 34.8,31.09 32.06,33.83 28.4,33.83 26.57,32 25.66,32 IC2.15
_RESET
  Top 0.254: IC1.13 44.63,32.46 34.8,32.46 32.52,34.75 25.89,34.75 25.66,34.52 IC2.17
_SCLK
  Top 0.254: IC1.17 46.23,28.8 46.23,29.49 46.46,29.72 52.18,29.72 52.41,29.49 52.41,27.2 46.92,21.72 42.81,21.72 38.46,26.06 26.8,26.06 24.06,28.8 24.06,29.72 24.75,30.4 25.43,30.4 IC2.14
_SRB1  (via drill 0.4)
  Top 0.16: 19.87,69.13 v19.9,69.1
  Top 0.254: R1.5 19.87,69.13 | U6.17 24.06,64.01 24.06,64.92 19.95,69.04 v19.9,69.1
  Bottom 0.254: v19.9,69.1 19.9,67.89 C3.5
_SRB2  (via drill 0.4)
  Top 0.254: v20.7,70.2 20.67,70.63 R1.6 20.86,72.01 20.4,72.47 19.49,72.47 19.03,72.01 19.03,67.67 23.6,63.09 24.06,63.09 U6.18
  Bottom 0.254: v20.7,70.2 20.7,67.64 C3.6
ARDUINO_RESET
  Top 0.254: IC1.29 53.32,33.38 56.29,33.38 57.89,34.98 C46.2 58.12,35.2 58.12,36.58 60.41,38.86 60.41,40.01 61.32,40.92 R8.1 61.55,40.92 63.15,40.92 | 63.15,40.92 63.38,40.92 65.89,38.41 S1.4 | 63.15,40.92 65.89,43.66 S1.3
AREF  (via drill 0.61)
  Top 0.254: v48.29,26.52 48.52,26.75 48.52,28.57 IC1.20 | v37.09,54.41 36.41,54.41 32.52,58.29 v28.18,58.29
  Bottom 0.254: v48.29,26.52 48.29,37.49 48.98,38.18 48.98,39.09 41,47.07 41,51 42.12,52.12 42.12,53.49 41.2,54.41 v37.09,54.41 | v28.18,58.29 28.18,59.66 C27.1
BIAS
  Top 0.254: R6.1 42.61,77.36 SV1.6 SV1.5
  Bottom 0.254: D7.4 44.15,74.15 43.3,75 43.3,76.67 SV1.6
BIAS_DRV  (via drill 0.61)
  Top 0.254: 44.18,60.58 44.86,60.58 45.55,59.89 C16.2 | 44.18,60.58 41.66,60.58 R5.2 | R6.8 42.81,72.01 43.26,72.47 43.26,80.92 44.18,81.84 44.86,81.84 45.78,80.92 45.78,73.15 44.18,71.55 v44.18,69.72 v44.18,64.92 | v44.18,61.95 44.18,60.58
  Bottom 0.254: v44.18,69.72 42.12,67.67 C35.8 | v44.18,64.92 v44.18,61.95
CS1  (via drill 0.61)
  Top 0.254: v24.98,45.03 26.35,45.03 30.69,49.38 30.69,50.06 U6.39 | v21.77,30.86 v21.77,33.6 | v16.29,25.38 15.14,25.38 13.77,24 8.29,24 6.92,25.38 6.92,27.66 9.89,30.63 v9.89,33.15 | v12.4,37.72 15.6,34.52 16.52,34.52 IC2.8
  Bottom 0.254: v24.98,45.03 24.98,44.35 22,41.38 22,38.41 21.77,38.18 v21.77,33.6 | v16.29,25.38 v21.77,30.86 | v9.89,33.15 12.4,35.66 v12.4,37.72
DVDD  (via drill 0.61)
  Top 0.254: v37.09,51.66 37.78,50.98 37.78,50.29 U6.48 | 40.75,53.03 39.83,53.03 U6.50 | 40.75,53.03 40.75,54.18 40.52,54.41 39.83,54.41 U6.52 | 40.75,53.03 v41.2,53.03 | 41.66,43.43 40.52,42.29 C12.1 | 41.66,43.43 43.26,43.43 43.49,43.2 43.49,39.78 43.95,39.32 43.95,37.26 43.72,37.03 42.12,37.03 40.98,38.18 C14.1 | 41.66,43.43 v39.83,45.26 | v11.49,24.92 12.86,24.92 13.77,25.83 14.23,25.83 U5.5 | v14.69,42.75 16.06,42.75 16.52,43.2 IC2.1 | v20.63,44.58 21.77,45.72 21.77,46.18 C43.2
  Bottom 0.254: 39.83,51.66 v37.09,51.66 36.18,51.66 35.31,50.8 34.29,50.8 30.48,46.99 30.48,38.1 33.02,35.56 33.02,34.29 35.31,32 35.31,30.73 36.83,29.21 36.83,20.32 35.48,18.97 14.69,18.97 11.26,22.4 11.26,24.69 v11.49,24.92 11.49,27.2 7.37,31.32 6.78,31.32 6.35,31.75 6.35,39.37 10.16,43.18 14.26,43.18 v14.69,42.75 16.52,44.58 v20.63,44.58 | v41.2,53.03 39.83,51.66 | v39.83,45.26 39.83,51.66
GND  (via drill 0.6, 0.61)  (1 unrouted)
  Top 0.254: 25.66,52.12 24.98,52.81 24.29,52.81 U6.31 | 25.66,52.12 25.89,51.89 25.89,50.29 U6.33 25.89,50.06 23.6,50.06 19.95,46.41 C43.1 19.72,46.18 19.72,44.35 17.43,42.06 16.75,42.06 IC2.2 16.52,41.83 11.72,41.83 10.34,40.46 R12.1 10.12,40.23 10.12,39.55 8.97,38.41 8.97,35.43 10.8,33.6 10.8,29.95 | 25.66,52.12 27.26,53.72 29.55,53.72 v30.23,53.03 32.29,50.98 32.29,50.29 U6.41 | 42.81,39.55 42.81,41.83 42.58,42.06 C12.2 | 42.81,39.55 42.81,38.41 C14.2 | 13.54,29.26 13.54,28.57 U5.2 | 13.54,29.26 13.77,29.49 16.52,29.49 IC2.12 16.75,29.49 16.75,30.4 IC2.11 16.75,30.63 17.43,30.63 19.72,32.92 19.72,35.43 24.98,40.69 25.43,40.69 IC2.22 25.66,40.69 26.35,40.69 27.72,39.32 35.03,39.32 35.26,39.55 42.81,39.55 | 10.8,29.95 8.06,27.2 8.06,26.29 C44.1 | 10.8,29.95 12.86,29.95 13.54,29.26 | 28.86,27.43 27.49,27.43 26.12,28.8 | 28.86,27.43 32.52,27.43 U4.2 | 26.12,28.8 25.66,29.26 IC2.13 | 26.12,28.8 27.26,29.95 27.26,31.09 27.95,31.77 28.4,31.77 VR1.1 28.63,32 29.55,32.92 v31.6,32.92 | v28.86,28.8 28.86,27.43 | U6.51 39.6,53.49 38.92,53.49 38.69,53.26 38.69,52.58 39.15,52.12 39.6,52.12 U6.49 39.83,52.12 46.92,52.12 48.75,53.95 | 57.89,47.09 58.35,47.09 U9.2 | 57.89,47.09 56.98,46.18 56.98,45.49 55.84,44.35 55.84,43.2 C41.1 55.61,42.98 55.61,39.32 C45.1 54.78,39.2 v53.34,40.64 | 58.12,48.92 57.66,48.92 57.44,48.69 57.44,47.55 57.89,47.09 | 58.12,48.92 59.27,48.92 60.41,47.78 61.32,47.78 C42.1 | 48.75,53.95 53.09,53.95 58.12,48.92 | R6.2 41.89,73.15 41.89,72.01 R6.7 41.89,71.78 41.89,71.09 | 41.89,71.09 41.89,66.06 41.66,65.84 | 41.66,65.84 39.83,64.01 U6.64 39.6,63.78 38.92,63.78 38.69,63.55 38.69,61.27 39.15,60.81 39.6,60.81 U6.60
  Top 0.254: SV1.3 44.63,80.47 44.63,78.18 SV1.4 44.41,77.95 44.41,72.47 43.03,71.09 41.89,71.09 | 48.75,53.95 48.75,58.75 41.66,65.84 | v55.88,17.78 v58.42,17.78
  Bottom 0.254: v31.6,32.92 31.6,34.52 C29.2 | C33.2 25.66,26.75 27.95,26.75 28.18,26.98 C30.2 28.4,27.2 28.4,28.8 | 23.83,37.03 22.92,37.03 C37.1 | 24.75,36.12 26.57,34.29 C32.1 | 24.75,36.12 23.83,37.03 | 24.75,36.12 23.38,34.75 23.38,32 C36.1 | 28.4,28.8 28.4,29.26 25.89,31.77 23.38,31.77 C36.1 | 28.4,28.8 v28.86,28.8 | 12.63,33.38 13.54,34.29 C38.1 | 12.63,33.38 10.8,31.55 10.12,31.55 D9.A | C31.2 29.55,23.32 27.72,21.49 27.26,21.49 U3.1 27.03,21.26 27.03,20.8 26.12,19.89 24.06,19.89 19.49,24.46 12.4,24.46 | 12.4,24.46 12.4,29.03 14.46,31.09 C39.1 | 12.4,24.46 12.4,23.32 C40.2 | 14.23,31.77 12.63,33.38 | 14.23,31.77 14.23,31.32 C39.1 | 14.23,31.77 23.15,31.77 C36.1 | 14.23,31.77 C39.1 | 35.95,66.29 35.49,66.29 | 35.95,66.29 36.41,66.29 | 35.95,66.29 C28.3 | 36.41,66.29 36.86,66.29 | 36.41,66.29 C28.2 | 40.98,66.29 40.52,66.29 | 40.98,66.29 41.43,66.29 C35.2 41.66,66.29 42.12,66.29 C35.1 42.12,66.52 42.39,66.52 44.45,68.58 45.72,68.58 46.99,69.85 46.99,72.62 46.01,73.61 | 40.98,66.29 C35.3 | 40.52,66.29 36.86,66.29 | 36.86,66.29 C28.1 | 40.52,66.29 C35.4 | 25.89,66.52 25.43,66.52 C9.4 | 25.89,66.52 26.35,66.52 | 25.89,66.52 C9.3 25.89,66.29 25.89,64.47 C24.2 | 26.35,66.52 27.03,66.52 C9.1 27.03,66.29 28.63,64.69 C22.2 | 26.35,66.52 C9.2 | 30.92,66.29 30.46,66.29 | 30.92,66.29 31.38,66.29 | 30.92,66.29 C11.3 | 31.38,66.29 31.83,66.29 | 31.38,66.29 C11.2 | 30.46,66.29 28.86,64.69 C22.2 | 30.46,66.29 C11.4 | 31.83,66.29 35.49,66.29 | 35.49,66.29 C28.4 | 31.83,66.29 C11.1 | C22.2 28.86,64.47 30,63.32 32.29,63.32 32.52,63.09 32.52,59.44 C18.2 32.75,59.21 32.75,55.55 C21.2 32.52,55.32 v30.23,53.03 27.95,50.75 27.95,45.73 24.13,41.91 24.13,37.33 23.83,37.03
  Bottom 0.254: 46.01,73.61 45.78,73.61 | 45.78,73.61 43.95,73.61 43.49,74.07 41.66,74.07 D6.3 41.43,74.07 40.98,74.07 40.29,73.38 37.09,73.38 36.41,74.07 D5.3 36.18,74.07 35.72,74.07 35.26,73.61 32.06,73.61 31.6,74.07 D4.3 31.38,74.07 30.92,73.61 28.71,73.61 28.25,74.07 26.35,74.07 D3.3 26.12,74.07 25.66,73.61 23.6,73.61 | 46.01,73.61 46.46,74.07 D7.3 | 46.01,75.44 46.46,75.44 D7.1 | 46.01,75.44 45.78,75.21 45.78,73.61 | 46.01,75.44 46.01,76.58 44.63,77.95 SV1.4 | 20.63,66.52 20.17,66.52 | 20.63,66.52 21.09,66.52 | 20.63,66.52 C3.3 | 21.09,66.52 21.77,66.52 | 21.09,66.52 C3.2 | 20.17,66.52 18.12,66.52 17.66,66.98 C34.1 | 20.17,66.52 C3.4 | 23.6,73.61 23.15,74.07 21.09,74.07 D2.3 | 21.77,66.52 23.6,68.35 23.6,73.61 | 21.77,66.52 C3.1 | UART.3 63.08,3.39 68.58,8.89 68.58,11.43 64.77,15.24 60.96,15.24 v58.42,17.78 | v53.34,40.64 52.07,39.37 52.07,35.56 53.34,34.29 53.34,20.32 v55.88,17.78
  pour Top: -7,91 87,91 87,-6 -7,-6
IN1N  (via drill 0.4)
  Top 0.16: 22.5,70 v22.4,70.1
  Top 0.254: R1.8 22.27,70.23 v22.4,70.1 | U6.15 26.9,66.3 26.5,66.7 25,66.7 22.5,69.2 22.5,70
  Bottom 0.254: v22.4,70.1 22.4,68.33 C3.8
IN1P  (via drill 0.4)
  Top 0.254: R1.7 21.47,69.43 v21.5,69.1 24.86,65.74 U6.16
  Bottom 0.254: v21.5,69.1 21.5,68.8 21.2,68.5 21.2,67.64 C3.7
IN2N  (via drill 0.4)
  Top 0.16: v25.79,70.01 v25.8,70
  Top 0.254: R2.6 v25.79,70.01 | U6.13 28.48,66.52 27.27,67.73 26.37,67.73 25.8,68.3 v25.8,70
  Bottom 0.254: v25.8,70 25.8,68.3 25.81,68.3 25.91,68.2 25.91,67.62 C9.6
IN2P  (via drill 0.4)
  Top 0.254: R2.5 24.99,69.29 v24.8,69.1 24.8,68.22 25.82,67.2 26.9,67.2 27.69,66.41 U6.14
  Bottom 0.254: v24.8,69.1 24.8,68.22 C9.5
IN3N  (via drill 0.4)
  Top 0.254: R2.8 27.8,71.39 v27.8,70 27.8,68.8 30.05,66.55 U6.11
  Bottom 0.254: C9.8 26.95,67.95 27.8,68.8 v27.8,70
IN3P  (via drill 0.4)
  Top 0.254: R2.7 26.59,69.41 v26.8,69.1 29.26,66.64 U6.12
  Bottom 0.254: v26.8,69.1 26.4,68.7 26.4,67.62 C9.7
IN4N  (via drill 0.4)  (1 unrouted)
  Top 0.254: R3.6 30.85,70.35 30.8,70.3 v30.8,70 30.9,69.9 30.9,68.1 31.63,67.37 U6.9
  Bottom 0.254: v30.8,70 30.8,68.13 30.86,68.07 30.86,67.6
IN4P  (via drill 0.4)  (1 unrouted)
  Top 0.254: 30,71.75 30,69.3 v29.8,69.1 29.8,68.17 30.84,67.13 U6.10
  Bottom 0.254: v29.8,69.1 29.8,68.17 C11.5
IN5N  (via drill 0.4)
  Top 0.254: R3.8 32.45,70.35 v32.8,70 32.8,68.5 33.2,68.1 U6.7
  Bottom 0.254: v32.8,70 32.8,68.41 C11.8
IN5P  (via drill 0.4)  (1 unrouted)
  Top 0.254: R3.7 31.65,69.25 v31.8,69.1 31.8,68.5 32.41,67.89 U6.8
  Bottom 0.254: v31.8,69.1 31.8,68.5 31.4,68.1 31.4,67.56
IN6N  (via drill 0.4)
  Top 0.254: R4.6 35.93,70.13 v35.8,70 35.8,68.5 34.78,67.48 U6.5
  Bottom 0.254: v35.8,70 35.8,68.2 36,68 36,67.56 C28.6
IN6P  (via drill 0.4)
  Top 0.254: U6.6 33.99,68.29 v34.8,69.1 34.8,71.37 35.13,71.71 R4.5
  Bottom 0.254: v34.8,69.1 34.8,68.17 C28.5
IN7N  (via drill 0.4)
  Top 0.254: R4.8 37.53,70.27 v37.8,70 37.8,68.6 36.35,67.15 U6.3
  Bottom 0.254: v37.8,70 37.8,68.36 C28.8
IN7P  (via drill 0.4)
  Top 0.254: R4.7 36.73,69.23 v36.8,69.1 36.8,68.6 35.56,67.36 U6.4
  Bottom 0.254: v36.8,69.1 36.8,68.3 36.46,67.96 C28.7
IN8N  (via drill 0.4)  (1 unrouted)
  Top 0.254: R6.6 41.01,70.09 v41,70 41,68.4 38.34,65.74 U6.1
  Bottom 0.254: v41,70 41,67.58
IN8P  (via drill 0.4)
  Top 0.254: R6.5 40.21,69.21 v40,69.1 39.1,69.1 37.14,67.14 U6.2
  Bottom 0.254: v40,69.1 40,68.08 C35.5
MOSI
  Top 0.254: U6.34 26.8,50.06 26.8,48.23 18.8,40.23 18.8,34.52 17.43,33.15 16.75,33.15 IC2.9
N$1
  Top 0.254: IC1.32 53.32,35.89 54.69,35.89 56.29,37.49 58.35,37.49 59.95,39.09 59.95,41.6 65.67,47.32 R9.1
N$2
  Top 0.254: IC1.7 46.92,37.26 46.92,38.86 45.32,40.46 C20.2 45.32,40.69 45.32,42.32 47,44 51,44 53,46 53,47.78 | 51.26,47.78 X1.2 51.44,47.78 53,47.78 | 53,47.78 53,48 | 53.03,47.78 53,47.78
N$3
  Top 0.254: 43.26,46.63 42.12,47.78 X1.1 | 43.26,46.63 43.95,45.95 43.95,40.01 46.01,37.95 46.01,37.26 IC1.8 | 43.26,46.63 43.49,46.63 43.49,50.22 44,50.73 47.57,50.73 C23.2 49.44,52.58
N$4
  Top 0.254: U6.63 39.83,63.09 39.83,62.41 U6.62 39.83,62.18 40.52,62.18 40.75,61.95 40.75,59.44 41.43,58.75 R5.1 41.66,58.52 42.35,57.84 45.55,57.84 C16.1
N$5
  Top 0.254: U6.55 39.83,56.69 41.89,56.69 42.81,55.78 C15.2 43.03,55.55 45.55,55.55 C19.2
N$6
  Top 0.254: 24.06,56.92 U6.26 23.91,57.15 19.05,57.15 18.63,57.57 C6.1
N$7
  Top 0.254: U6.24 24.06,58.52 23.38,58.52 20.86,61.04 20.86,62.96 20.21,63.61 20.2,63.61 | 20.2,63.61 19.72,63.09 18.82,62.2 C1.2 | 20.2,63.61 C5.2
N$8
  Top 0.254: U6.28 24.06,55.09 19.72,55.09 19.26,54.63 C2.+
N$9
  Bottom 0.254: U3.6 27.26,23.77 27.95,23.77 29.55,25.38 32.75,25.38 33.89,24.23 C25.1
N$10
  Top 0.254: U6.30 24.06,53.49 23.38,53.49 20.17,50.29 20.17,49.84 C7.1
N$11  (via drill 0.61)
  Top 0.254: v31.38,22.4 v24.75,22.4
  Bottom 0.254: v24.75,22.4 25.2,21.95 25.2,21.49 U3.3 | v31.38,22.4 31.38,23.77 31.6,24 C25.2
N$12  (via drill 0.61)
  Top 0.254: v30,30.86 30.92,29.95 VR1.4
  Bottom 0.254: v30,30.86 27.95,30.86 24.75,34.06 C32.2
N$14
  Top 0.254: D8.C 9.89,37.95 12.17,40.23 R12.2
N$38  (via drill 0.61)
  Top 0.254: v55.84,49.84 55.84,48.23 U9.4
  Bottom 0.254: C38.2 13.77,36.35 15.83,38.41 20.4,38.41 21.55,39.55 21.55,45.03 14.46,52.12 14.46,80.24 16.06,81.84 47.38,81.84 48.29,80.92 48.62,80.92 49.53,80.01 49.53,59.6 55.84,53.3 v55.84,49.84
NC
  Top 0.254: 25.2,54.63 24.98,54.41 24.29,54.41 U6.29 | 25.2,54.63 25.2,55.78 24.98,56.01 24.29,56.01 U6.27 | 25.2,54.63 35.49,54.63 38.69,51.44 38.69,48.92 36.63,46.86 31.15,46.86 26.35,42.06 25.66,42.06 IC2.23
NULL  (via drill 0.61)
  Top 0.254: v8.74,33.83 8.74,30.18 6.46,27.89 6.46,18.06 8.29,16.23 9.43,16.23 10.57,17.37 10.57,18.97 BATT.1
  Bottom 0.254: v8.74,33.83 8.74,34.06 9.89,35.2 D9.C
PE  (via drill 0.61)
  Top 0.254: 49.21,27.2 49.21,24.69 46.69,22.17 45.09,22.17 44.63,22.63 44.63,24.23 45.78,25.38 C26.2 | 49.21,27.2 49.21,28.57 IC1.21 | IC1.5 48.75,37.03 48.75,36.35 48.98,36.12 49.89,36.12 50.12,36.35 50.12,37.03 IC1.3 50.35,37.26 50.35,38.41 v50.58,38.63 | C20.1 47.38,40.69 v48.75,40.69 54.69,46.63 54.69,49.38 51.49,52.58 C23.1 | v49.44,27.2 49.21,27.2 | S1.2 70.01,38.41 70.01,43.66 S1.1 69.78,43.89 69.78,47.32 67.72,49.38 59.04,49.38 v58.58,49.84 45.55,62.87 v45.55,69.72
  Bottom 0.254: 48.98,40.23 48.75,40.46 v48.75,40.69 48.98,40.23 | 48.98,40.23 v50.58,38.63 49.44,37.49 v49.44,27.2 | v45.55,69.72 44.41,70.87 25.43,70.87 24.06,69.49 24.06,61.95 26.12,59.89 C27.2 | v58.58,49.84 48.98,40.23
RAW
  Top 0.254: BATT.2 8.97,19.2 8.97,20.57 10.12,21.72 15.49,21.72 17.26,19.95 64.77,19.95 66.97,17.75 SW1.B
RAW_SWITCH  (via drill 0.61)
  Top 0.254: U9.3 58.58,48.01 59.27,48.01 59.49,47.78 59.49,46.86 59.04,46.41 58.58,46.41 U9.1 58.35,46.18 56.75,44.58 56.75,41.83 v57.66,40.92 57.66,39.55 57.44,39.32 C45.2 | v66.12,32.46 66.12,21.32 SW1.C
  Bottom 0.254: v57.66,40.92 v66.12,32.46
RESET  (via drill 0.61)
  Top 0.254: v25.89,45.95 28.4,48.46 28.4,50.06 U6.36 | v23.15,45.95 23.15,45.26 18.34,40.46 18.34,36.58 17.43,35.66 16.75,35.66 IC2.7
  Bottom 0.254: v23.15,45.95 v25.89,45.95
RX  (via drill 0.6)
  Top 0.254: v66,11 PROGRAM.2
  Bottom 0.254: UART.2 60.54,3.54 66,9 v66,11
RX_ATM  (via drill 0.61)
  Top 0.254: UARTCONNECT.5 49.84,11.2 52.81,11.2 v55.09,13.49 57.15,13.49 PROGRAM.4 | v51.89,33.38 52.58,34.06 53.26,34.06 IC1.30
  Bottom 0.254: v51.89,33.38 51.89,16.69 v55.09,13.49
RX_ORB  (via drill 0.61)
  Top 0.254: 56.24,9.37 56.46,9.37 57.15,8.69 PROGRAM.6 | 56.24,9.37 49.15,9.37 47.55,7.77 46.41,7.77 45.72,8.46 44.35,8.46 UARTCONNECT.1 | v64.69,50.29 64.01,50.29 56.69,57.61 56.69,58.29 U$5.33 | 56.24,9.37 v56.24,9.83
  Bottom 0.254: v64.69,50.29 64.69,49.15 56.69,41.15 56.69,33.15 56.92,32.92 56.92,10.52 v56.24,9.83
SCL  (via drill 0.6, 0.61)
  Top 0.254: v54.63,32.46 53.49,32.46 IC1.28 | U$5.10 66.75,81.25 66,82 54,82 51,79 51,59.49 57.15,53.34 57.15,52.58 v57.46,52.27
  Bottom 0.254: v54.63,32.46 54.63,44.58 54.74,44.58 57.15,46.99 58.42,46.99 60.96,49.53 58.42,52.07 57.66,52.07 v57.46,52.27
SCLK
  Top 0.254: D8.A 11.49,37.72 11.49,36.35 15.83,32 16.52,32 IC2.10 16.75,32 17.66,32 19.26,33.6 19.26,40.01 23.38,44.12 26.12,44.12 31.6,49.61 31.6,50.06 U6.40
SDA  (via drill 0.6, 0.61)
  Top 0.254: v56.01,32.46 55.09,31.55 53.49,31.55 IC1.27 | U$5.9 65.48,79.48 v64,78
  Bottom 0.254: v56.01,32.46 56.01,42.98 62.64,49.61 52,60.24 52,68.51 53.34,69.85 62.23,69.85 63.5,71.12 63.5,77.5 v64,78 | 65.61,80.47 U$5.9
SRB1
  Top 0.16: SV1.24
  Top 0.254: R1.4 19.75,73.16 19.1,73.8 SV1.24
  Bottom 0.254: D2.5 18.81,74.79 18.5,75.1 18.5,77.43 SV1.24
SRB2
  Top 0.254: R1.3 20.67,73.93 20.3,74.3 20.3,79.35 SV1.23
  Bottom 0.254: D2.2 20.51,74.79 20.2,75.1 20.2,79.45 SV1.23
TX  (via drill 0.6)
  Top 0.254: v54,11 PROGRAM.5
  Bottom 0.254: UART.1 56,3 54,5 v54,11
TX_ATM  (via drill 0.6)
  Top 0.254: 50,14.4 61.95,14.4 62.64,13.72 PROGRAM.1 | 50,14.4 46.63,14.4 44.35,12.12 44.35,11.2 UARTCONNECT.2 | v50.6,31.1 50.3,31.4 50.3,34.28 51,34.98 | v50,16 50,14.4 | IC2.21 25.66,39.32 26.57,39.32 29.32,36.58 45.32,36.58 46.92,34.98 51,34.98 | 51,34.98 53.28,34.98 IC1.31
  Bottom 0.254: v50.6,31.1 50.6,16.6 v50,16
TX_ORB  (via drill 0.6)
  Top 0.254: UARTCONNECT.4 49.84,8.46 55.55,8.46 56.46,7.54 61.72,7.54 62.64,8.46 PROGRAM.3 68.7,8.5 72,11.8 v72,32 | 59.21,58.52 U$5.31 61.65,58.35 v66,54
  Bottom 0.254: v66,54 69,54 72,51 v72,32